# EAGLE design ble_emg_recorder_v11 (EAGLE 6.4)

## Sheet 1 of 3
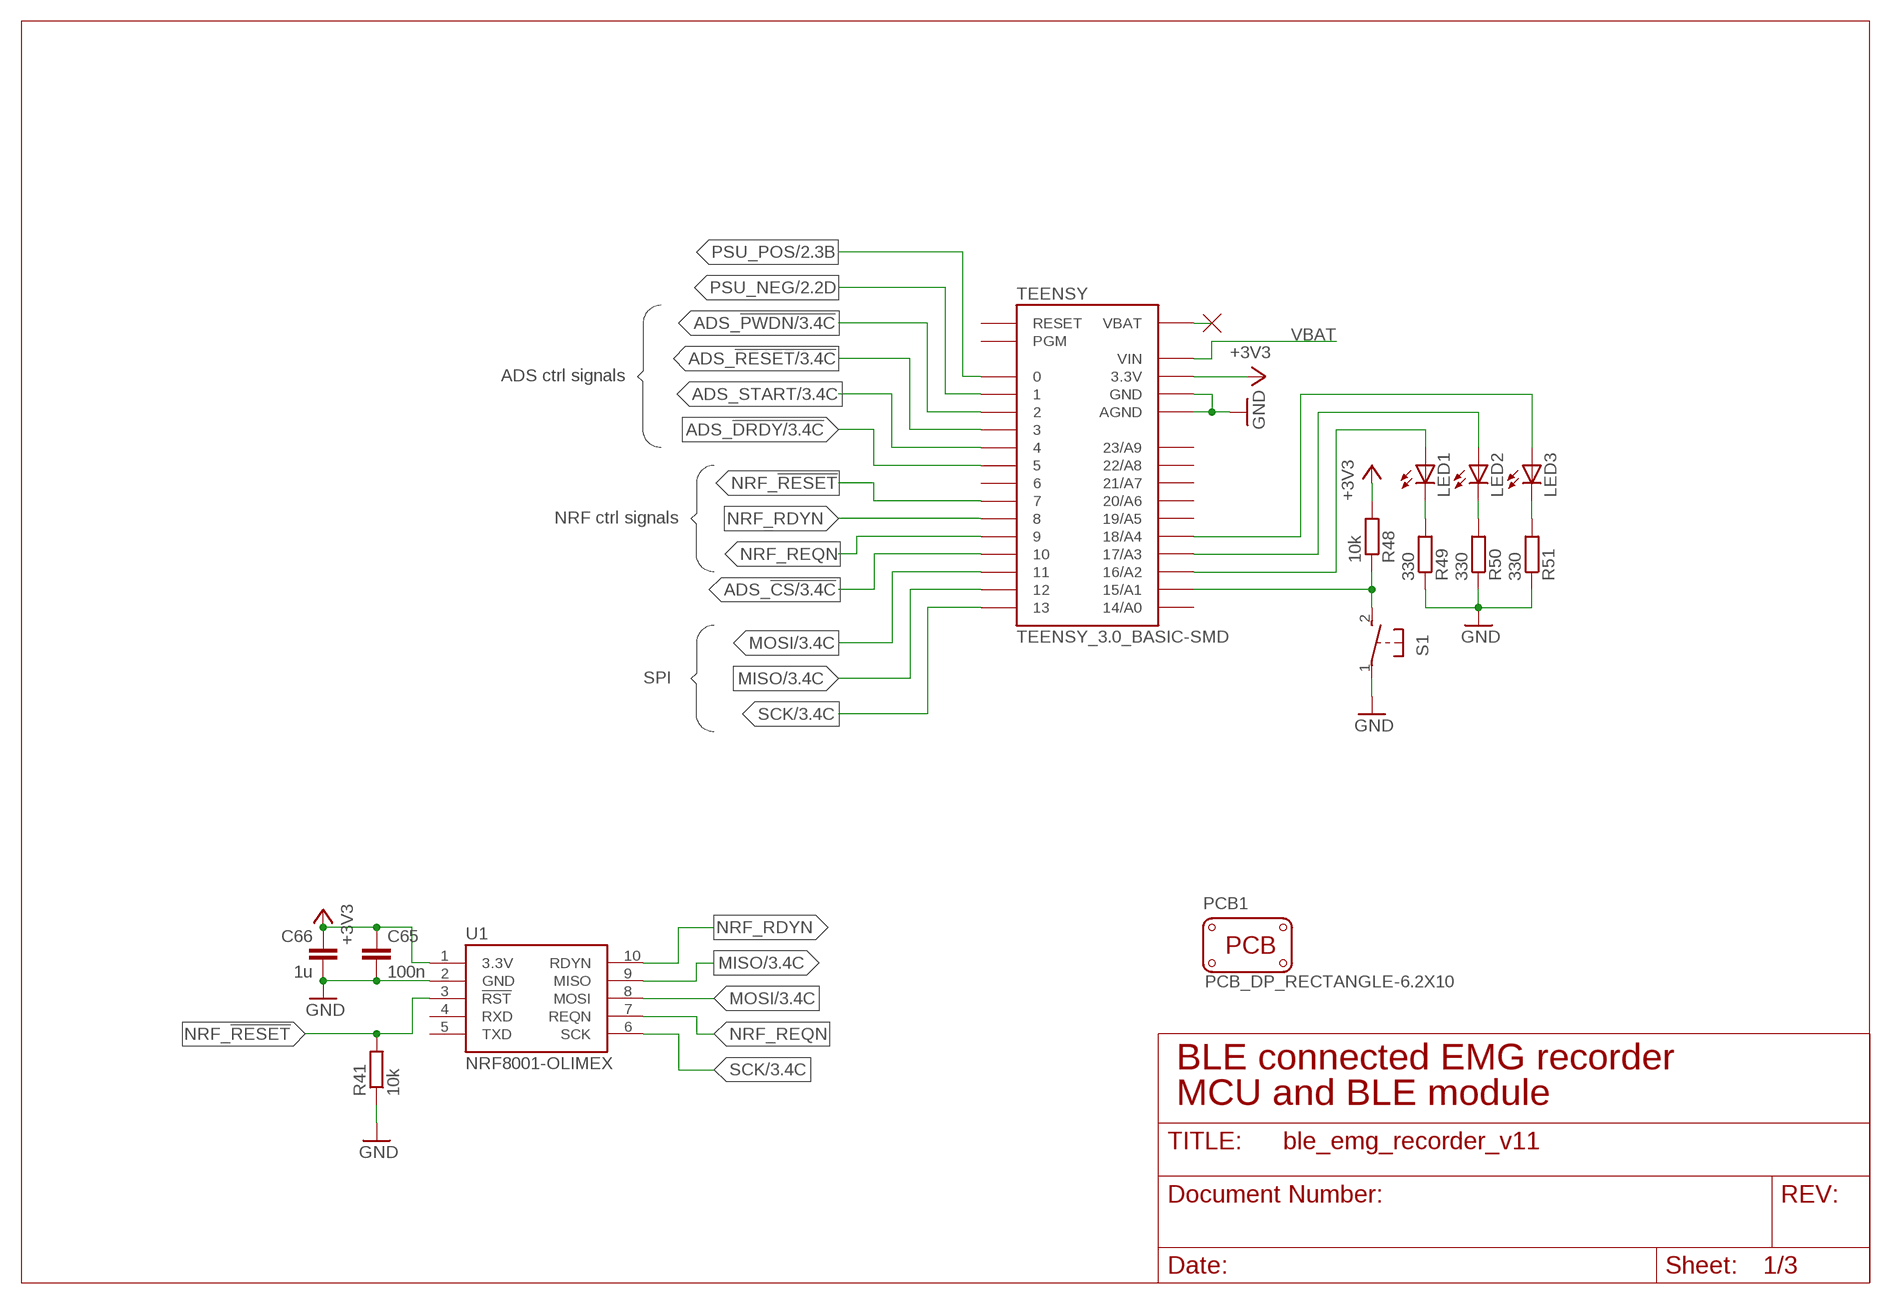
[diagram p0: schematic, sheet 1]

### Parts
C65  100n  C-EUC0805  [C0805]
C66  1u  C-EUC0805  [C0805]
LED1  LEDCHIPLED_0805  [CHIPLED_0805]
LED2  LEDCHIPLED_0805  [CHIPLED_0805]
LED3  LEDCHIPLED_0805  [CHIPLED_0805]
PCB1  PCB_DP_RECTANGLE-6.2X10  [DP10062_V1]
R41  10k  R-EU_R0805  [R0805]
R48  10k  R-EU_R0805  [R0805]
R49  330  R-EU_R0805  [R0805]
R50  330  R-EU_R0805  [R0805]
R51  330  R-EU_R0805  [R0805]
S1  31-XX  [B3F-31XX]
TEENSY  TEENSY_3.0_BASIC-SMD  [TEENSY_3.0_BASIC-SMD]
U1  NRF8001-OLIMEX  [NRF8001-OLIMEX]

### Nets
+3V3: C65.1 C66.1 R48.2 TEENSY.3.3V TEENSY.3.3V1(3.3V) U1.1(3.3V) ; also sheet 3
ADS_!CS: TEENSY.10 ; also sheet 3
ADS_!DRDY: TEENSY.5 ; also sheet 3
ADS_!PWDN: TEENSY.2 ; also sheet 3
ADS_!RESET: TEENSY.3 ; also sheet 3
ADS_START: TEENSY.4 ; also sheet 3
GND: C65.2 C66.2 R41.1 R49.1 R50.1 R51.1 S1.1(P) TEENSY.AGND TEENSY.GND TEENSY.GND1(GND) U1.2(GND) ; also sheet 2,3
MISO: TEENSY.12 U1.9(MISO) ; also sheet 3
MOSI: TEENSY.11 U1.8(MOSI) ; also sheet 3
N$4: R48.1 S1.2(S) TEENSY.15/A1
N$7: LED1.A TEENSY.16/A2
N$9: TEENSY.VBAT
N$10: LED2.A TEENSY.17/A3
N$13: LED3.A TEENSY.18/A4
N$16: LED1.C R49.2
N$19: LED2.C R50.2
N$22: LED3.C R51.2
NRF_!RESET: R41.2 TEENSY.7 U1.3(!RST)
NRF_RDYN: TEENSY.8 U1.10(RDYN)
NRF_REQN: TEENSY.9 U1.7(REQN)
PSU_NEG: TEENSY.1 ; also sheet 2
PSU_POS: TEENSY.0 ; also sheet 2
SCK: TEENSY.13 U1.6(SCK) ; also sheet 3
VBAT: TEENSY.VIN ; also sheet 2
Unconnected: TEENSY.6 TEENSY.14/A0 TEENSY.19/A5 TEENSY.20/A6 TEENSY.21/A7 TEENSY.22/A8 TEENSY.23/A9 TEENSY.PGM TEENSY.RESET U1.4(RXD) U1.5(TXD)

### Notes on the sheet
- ADS ctrl signals
- NRF ctrl signals
- SPI
- BLE connected EMG recorder
- MCU and BLE module

## Sheet 2 of 3
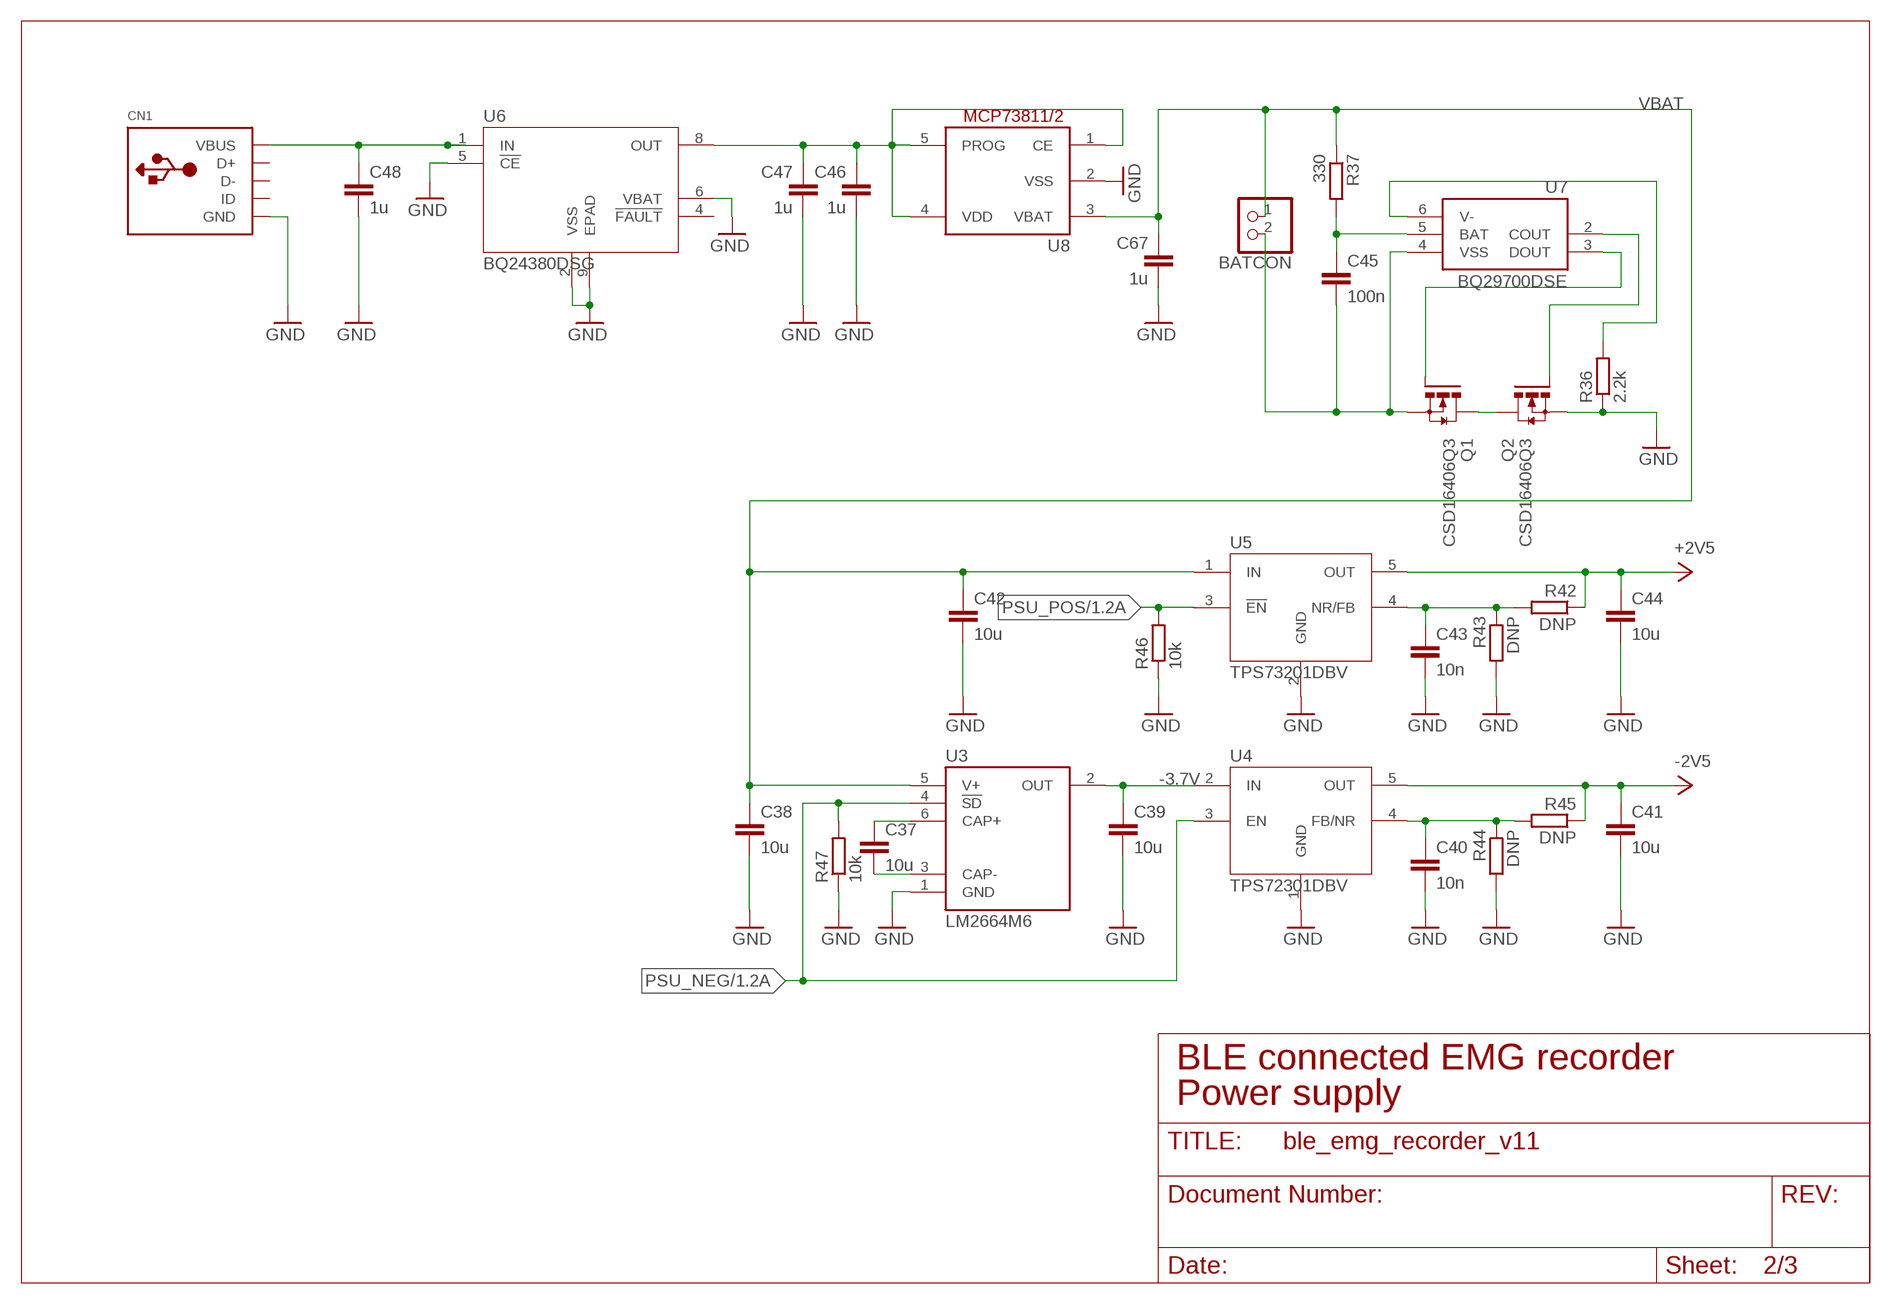
[diagram p1: schematic, sheet 2]

### Parts
BATCON  JST_2PIN-THM-RA  [JST-PH-2-THM-RA]
C37  10u  C-EUC0805  [C0805]
C38  10u  C-EUC0805  [C0805]
C39  10u  C-EUC0805  [C0805]
C40  10n  C-EUC0805  [C0805]
C41  10u  C-EUC0805  [C0805]
C42  10u  C-EUC0805  [C0805]
C43  10n  C-EUC0805  [C0805]
C44  10u  C-EUC0805  [C0805]
C45  100n  C-EUC0805  [C0805]
C46  1u  C-EUC0805  [C0805]
C47  1u  C-EUC0805  [C0805]
C48  1u  C-EUC0805  [C0805]
C67  1u  C-EUC0805  [C0805]
CN1  USBMINIB  [USB-MINIB]
Q1  CSD16406Q3  [DQV8-L]
Q2  CSD16406Q3  [DQV8-L]
R36  2.2k  R-EU_R0805  [R0805]
R37  330  R-EU_R0805  [R0805]
R42  DNP  R-EU_R0805  [R0805]
R43  DNP  R-EU_R0805  [R0805]
R44  DNP  R-EU_R0805  [R0805]
R45  DNP  R-EU_R0805  [R0805]
R46  10k  R-EU_R0805  [R0805]
R47  10k  R-EU_R0805  [R0805]
U3  LM2664M6  [SOT95P300X120-6N]
U4  TPS72301DBV  [DBV5]
U5  TPS73201DBV  [DBV5]
U6  BQ24380DSG  [DSG8_P9X1P6]
U7  BQ29700DSE  [DSE6]
U8  MCP73811/2  [SOT23-5L]

### Nets
+2V5: C44.1 R42.1 U5.5(OUT) ; also sheet 3
-2V5: C41.1 R45.1 U4.5(OUT) ; also sheet 3
GND: C38.2 C39.2 C40.2 C41.2 C42.2 C43.2 C44.2 C46.2 C47.2 C48.2 C67.2 CN1.GND Q2.1(S) Q2.2(S) Q2.3(S) R36.1 R43.2 R44.2 R46.1 R47.1 U3.1(GND) U4.1(GND) U5.2(GND) U6.2(VSS) U6.5(!CE) U6.6(VBAT) U6.9(EPAD) U8.2(VSS) ; also sheet 1,3
N$1: C40.1 R44.1 R45.2 U4.4(FB/NR)
N$3: C46.1 C47.1 U6.8(OUT) U8.1(CE) U8.4(VDD) U8.5(PROG)
N$21: C37.1 U3.6(CAP+)
N$27: C37.2 U3.3(CAP-)
N$30: C39.1 U3.2(OUT) U4.2(IN)
N$36: C43.1 R42.2 R43.1 U5.4(NR/FB)
N$39: BATCON.2 C45.2 Q1.1(S) Q1.2(S) Q1.3(S) U7.4(VSS)
N$42: Q2.4(G) U7.2(COUT)
N$45: Q1.4(G) U7.3(DOUT)
N$48: R36.2 U7.6(V-)
N$49: C45.1 R37.2 U7.5(BAT)
N$50: Q1.5(D) Q1.6(D) Q1.7(D) Q1.8(D) Q2.5(D) Q2.6(D) Q2.7(D) Q2.8(D)
PSU_NEG: R47.2 U3.4(!SD) U4.3(EN) ; also sheet 1
PSU_POS: R46.2 U5.3(!EN) ; also sheet 1
VAC: C48.1 CN1.VBUS U6.1(IN)
VBAT: BATCON.1 C38.1 C42.1 C67.1 R37.1 U3.5(V+) U5.1(IN) U8.3(VBAT) ; also sheet 1
Unconnected: CN1.D+ CN1.D- CN1.ID U6.4(!FAULT)

### Notes on the sheet
- -3.7V
- BLE connected EMG recorder
- Power supply

## Sheet 3 of 3
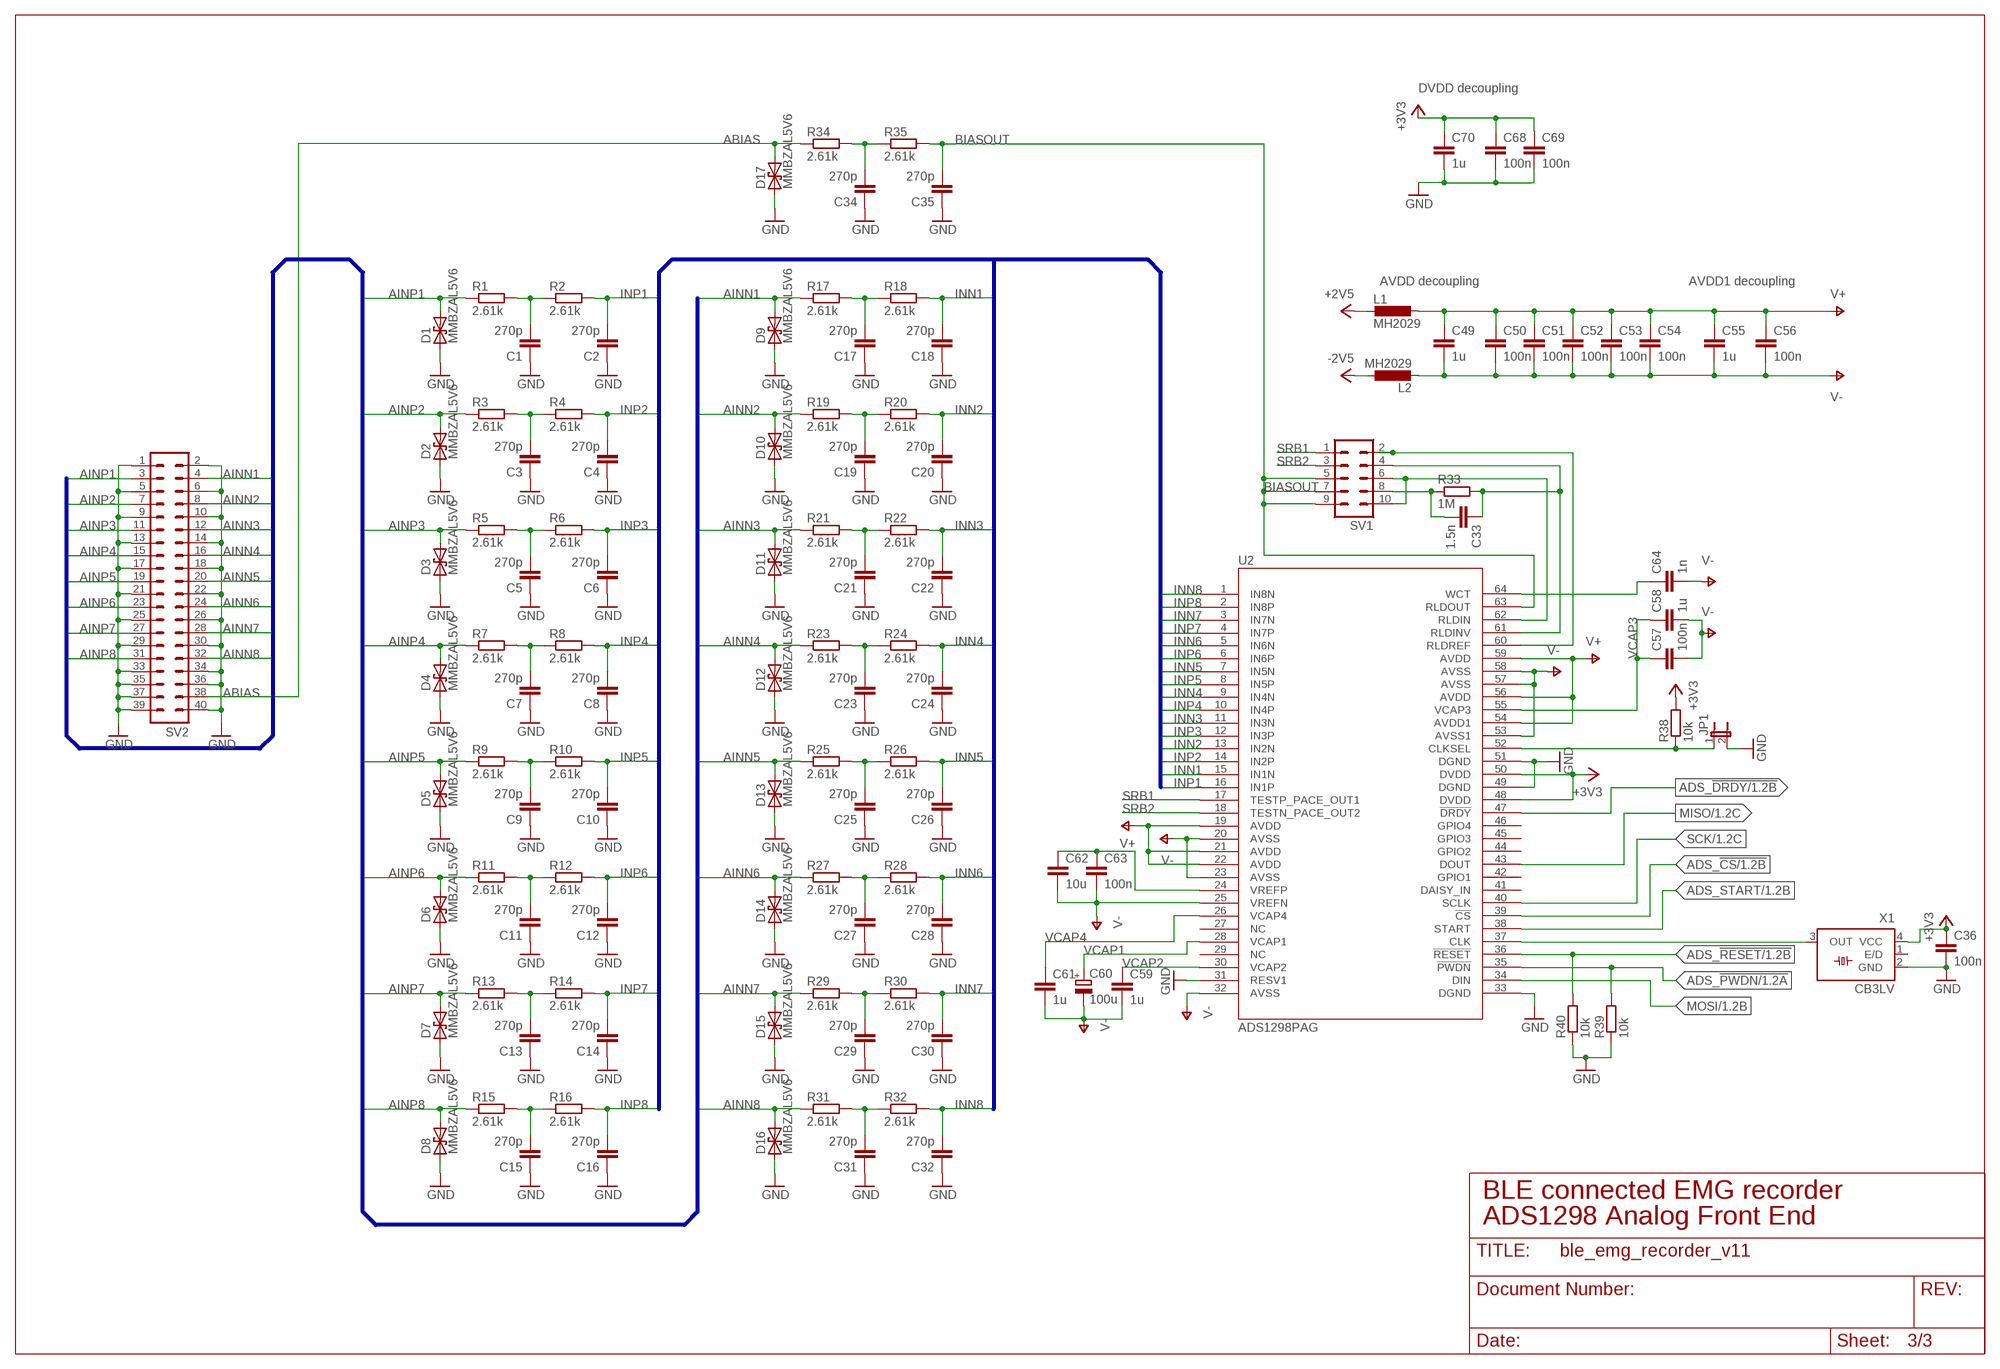
[diagram p2: schematic, sheet 3]

### Parts
C1  270p  C-EUC0805  [C0805]
C2  270p  C-EUC0805  [C0805]
C3  270p  C-EUC0805  [C0805]
C4  270p  C-EUC0805  [C0805]
C5  270p  C-EUC0805  [C0805]
C6  270p  C-EUC0805  [C0805]
C7  270p  C-EUC0805  [C0805]
C8  270p  C-EUC0805  [C0805]
C9  270p  C-EUC0805  [C0805]
C10  270p  C-EUC0805  [C0805]
C11  270p  C-EUC0805  [C0805]
C12  270p  C-EUC0805  [C0805]
C13  270p  C-EUC0805  [C0805]
C14  270p  C-EUC0805  [C0805]
C15  270p  C-EUC0805  [C0805]
C16  270p  C-EUC0805  [C0805]
C17  270p  C-EUC0805  [C0805]
C18  270p  C-EUC0805  [C0805]
C19  270p  C-EUC0805  [C0805]
C20  270p  C-EUC0805  [C0805]
C21  270p  C-EUC0805  [C0805]
C22  270p  C-EUC0805  [C0805]
C23  270p  C-EUC0805  [C0805]
C24  270p  C-EUC0805  [C0805]
C25  270p  C-EUC0805  [C0805]
C26  270p  C-EUC0805  [C0805]
C27  270p  C-EUC0805  [C0805]
C28  270p  C-EUC0805  [C0805]
C29  270p  C-EUC0805  [C0805]
C30  270p  C-EUC0805  [C0805]
C31  270p  C-EUC0805  [C0805]
C32  270p  C-EUC0805  [C0805]
C33  1.5n  C-EUC0805  [C0805]
C34  270p  C-EUC0805  [C0805]
C35  270p  C-EUC0805  [C0805]
C36  100n  C-EUC0805  [C0805]
C49  1u  C-EUC0805  [C0805]
C50  100n  C-EUC0402  [C0402]
C51  100n  C-EUC0402  [C0402]
C52  100n  C-EUC0402  [C0402]
C53  100n  C-EUC0402  [C0402]
C54  100n  C-EUC0402  [C0402]
C55  1u  C-EUC0805  [C0805]
C56  100n  C-EUC0402  [C0402]
C57  100n  C-EUC0402  [C0402]
C58  1u  C-EUC0805  [C0805]
C59  1u  C-EUC0805  [C0805]
C60  100u  CPOL-EUD/7343-31W  [D/7343-31W]
C61  1u  C-EUC0805  [C0805]
C62  10u  C-EUC0805  [C0805]
C63  100n  C-EUC0402  [C0402]
C64  1n  C-EUC0402  [C0402]
C68  100n  C-EUC0402  [C0402]
C69  100n  C-EUC0402  [C0402]
C70  1u  C-EUC0805  [C0805]
D1  MMBZAL5V6  [SOT23]
D2  MMBZAL5V6  [SOT23]
D3  MMBZAL5V6  [SOT23]
D4  MMBZAL5V6  [SOT23]
D5  MMBZAL5V6  [SOT23]
D6  MMBZAL5V6  [SOT23]
D7  MMBZAL5V6  [SOT23]
D8  MMBZAL5V6  [SOT23]
D9  MMBZAL5V6  [SOT23]
D10  MMBZAL5V6  [SOT23]
D11  MMBZAL5V6  [SOT23]
D12  MMBZAL5V6  [SOT23]
D13  MMBZAL5V6  [SOT23]
D14  MMBZAL5V6  [SOT23]
D15  MMBZAL5V6  [SOT23]
D16  MMBZAL5V6  [SOT23]
D17  MMBZAL5V6  [SOT23]
JP1  JP1E  [JP1]
L1  MH2029  FERRITE-FILTER  [L0805]
L2  MH2029  FERRITE-FILTER  [L0805]
R1  2.61k  R-EU_R0805  [R0805]
R2  2.61k  R-EU_R0805  [R0805]
R3  2.61k  R-EU_R0805  [R0805]
R4  2.61k  R-EU_R0805  [R0805]
R5  2.61k  R-EU_R0805  [R0805]
R6  2.61k  R-EU_R0805  [R0805]
R7  2.61k  R-EU_R0805  [R0805]
R8  2.61k  R-EU_R0805  [R0805]
R9  2.61k  R-EU_R0805  [R0805]
R10  2.61k  R-EU_R0805  [R0805]
R11  2.61k  R-EU_R0805  [R0805]
R12  2.61k  R-EU_R0805  [R0805]
R13  2.61k  R-EU_R0805  [R0805]
R14  2.61k  R-EU_R0805  [R0805]
R15  2.61k  R-EU_R0805  [R0805]
R16  2.61k  R-EU_R0805  [R0805]
R17  2.61k  R-EU_R0805  [R0805]
R18  2.61k  R-EU_R0805  [R0805]
R19  2.61k  R-EU_R0805  [R0805]
R20  2.61k  R-EU_R0805  [R0805]
R21  2.61k  R-EU_R0805  [R0805]
R22  2.61k  R-EU_R0805  [R0805]
R23  2.61k  R-EU_R0805  [R0805]
R24  2.61k  R-EU_R0805  [R0805]
R25  2.61k  R-EU_R0805  [R0805]
R26  2.61k  R-EU_R0805  [R0805]
R27  2.61k  R-EU_R0805  [R0805]
R28  2.61k  R-EU_R0805  [R0805]
R29  2.61k  R-EU_R0805  [R0805]
R30  2.61k  R-EU_R0805  [R0805]
R31  2.61k  R-EU_R0805  [R0805]
R32  2.61k  R-EU_R0805  [R0805]
R33  1M  R-EU_R0805  [R0805]
R34  2.61k  R-EU_R0805  [R0805]
R35  2.61k  R-EU_R0805  [R0805]
R38  10k  R-EU_R0805  [R0805]
R39  10k  R-EU_R0805  [R0805]
R40  10k  R-EU_R0805  [R0805]
SV1  MA05-2  [MA05-2]
SV2  ML40  [ML40]
U2  ADS1298PAG  [PAG64]
X1  CB3LV  SM77H  [SM77H]

### Nets
+2V5: L1.2 ; also sheet 2
+3V3: C36.1 C68.1 C69.1 C70.1 R38.2 U2.48(DVDD) U2.50(DVDD) X1.4(VCC) ; also sheet 1
-2V5: L2.1 ; also sheet 2
ABIAS: D17.2 R34.1 SV2.38
ADS_!CS: U2.39(!CS) ; also sheet 1
ADS_!DRDY: U2.47(!DRDY) ; also sheet 1
ADS_!PWDN: R39.2 U2.35(!PWDN) ; also sheet 1
ADS_!RESET: R40.2 U2.36(!RESET) ; also sheet 1
ADS_CLK: U2.37(CLK) X1.3(OUT)
ADS_START: U2.38(START) ; also sheet 1
AINN1: D9.2 R17.1 SV2.4
AINN2: D10.2 R19.1 SV2.8
AINN3: D11.2 R21.1 SV2.12
AINN4: D12.2 R23.1 SV2.16
AINN5: D13.2 R25.1 SV2.20
AINN6: D14.2 R27.1 SV2.24
AINN7: D15.2 R29.1 SV2.28
AINN8: D16.2 R31.1 SV2.32
AINP1: D1.2 R1.1 SV2.3
AINP2: D2.2 R3.1 SV2.7
AINP3: D3.2 R5.1 SV2.11
AINP4: D4.2 R7.1 SV2.15
AINP5: D5.2 R9.1 SV2.19
AINP6: D6.2 R11.1 SV2.23
AINP7: D7.2 R13.1 SV2.27
AINP8: D8.2 R15.1 SV2.31
BIASOUT: C35.2 R35.2 SV1.5 SV1.7 SV1.9 U2.63(RLDOUT)
GND: C1.1 C2.1 C3.1 C4.1 C5.1 C6.1 C7.1 C8.1 C9.1 C10.1 C11.1 C12.1 C13.1 C14.1 C15.1 C16.1 C17.1 C18.1 C19.1 C20.1 C21.1 C22.1 C23.1 C24.1 C25.1 C26.1 C27.1 C28.1 C29.1 C30.1 C31.1 C32.1 C34.1 C35.1 C36.2 C68.2 C69.2 C70.2 D1.1 D2.1 D3.1 D4.1 D5.1 D6.1 D7.1 D8.1 D9.1 D10.1 D11.1 D12.1 D13.1 D14.1 D15.1 D16.1 D17.1 JP1.2 R39.1 R40.1 SV2.1 SV2.2 SV2.5 SV2.6 SV2.9 SV2.10 SV2.13 SV2.14 SV2.17 SV2.18 SV2.21 SV2.22 SV2.25 SV2.26 SV2.29 SV2.30 SV2.33 SV2.34 SV2.35 SV2.36 SV2.37 SV2.39 SV2.40 U2.31(RESV1) U2.33(DGND) U2.49(DGND) U2.51(DGND) X1.2(GND) ; also sheet 1,2
INN1: C18.2 R18.2 U2.15(IN1N)
INN2: C20.2 R20.2 U2.13(IN2N)
INN3: C22.2 R22.2 U2.11(IN3N)
INN4: C24.2 R24.2 U2.9(IN4N)
INN5: C26.2 R26.2 U2.7(IN5N)
INN6: C28.2 R28.2 U2.5(IN6N)
INN7: C30.2 R30.2 U2.3(IN7N)
INN8: C32.2 R32.2 U2.1(IN8N)
INP1: C2.2 R2.2 U2.16(IN1P)
INP2: C4.2 R4.2 U2.14(IN2P)
INP3: C6.2 R6.2 U2.12(IN3P)
INP4: C8.2 R8.2 U2.10(IN4P)
INP5: C10.2 R10.2 U2.8(IN5P)
INP6: C12.2 R12.2 U2.6(IN6P)
INP7: C14.2 R14.2 U2.4(IN7P)
INP8: C16.2 R16.2 U2.2(IN8P)
MISO: U2.43(DOUT) ; also sheet 1
MOSI: U2.34(DIN) ; also sheet 1
N$2: C1.2 R1.2 R2.1
N$5: C3.2 R3.2 R4.1
N$6: C34.2 R34.2 R35.1
N$8: C5.2 R5.2 R6.1
N$11: C7.2 R7.2 R8.1
N$12: SV1.6 SV1.10 U2.62(RLDIN)
N$14: C9.2 R9.2 R10.1
N$15: C33.2 R33.1 SV1.8
N$17: C11.2 R11.2 R12.1
N$18: C33.1 R33.2 SV1.4 U2.61(RLDINV)
N$20: C13.2 R13.2 R14.1
N$23: C15.2 R15.2 R16.1
N$24: SV1.2 U2.60(RLDREF)
N$26: C17.2 R17.2 R18.1
N$29: C19.2 R19.2 R20.1
N$32: C21.2 R21.2 R22.1
N$35: C23.2 R23.2 R24.1
N$38: C25.2 R25.2 R26.1
N$41: C27.2 R27.2 R28.1
N$44: C29.2 R29.2 R30.1
N$47: C31.2 R31.2 R32.1
N$51: JP1.1 R38.1 U2.52(CLKSEL)
N$58: C64.1 U2.64(WCT)
SCK: U2.40(SCLK) ; also sheet 1
SRB1: SV1.1 U2.17(TESTP_PACE_OUT1)
SRB2: SV1.3 U2.18(TESTN_PACE_OUT2)
V+: C49.1 C50.1 C51.1 C52.1 C53.1 C54.1 C55.1 C56.1 L1.1 U2.19(AVDD) U2.21(AVDD) U2.22(AVDD) U2.54(AVDD1) U2.56(AVDD) U2.59(AVDD)
V-: C49.2 C50.2 C51.2 C52.2 C53.2 C54.2 C55.2 C56.2 C57.2 C58.2 C59.2 C60.- C61.2 C62.2 C63.2 C64.2 L2.2 U2.20(AVSS) U2.23(AVSS) U2.25(VREFN) U2.32(AVSS) U2.53(AVSS1) U2.57(AVSS) U2.58(AVSS)
VCAP1: C60.+ U2.28(VCAP1)
VCAP2: C59.1 U2.30(VCAP2)
VCAP3: C57.1 C58.1 U2.55(VCAP3)
VCAP4: C61.1 U2.26(VCAP4)
VREFP: C62.1 C63.1 U2.24(VREFP)
Unconnected: U2.27(NC) U2.29(NC) U2.41(DAISY_IN) U2.42(GPIO1) U2.44(GPIO2) U2.45(GPIO3) U2.46(GPIO4) X1.1(E/D)

### Buses
ADS-INPUTS:INP[1..8],INN[1..8]
ANALOG-INPUTS:AINN[1..8],AINP[1..8]

### Notes on the sheet
- DVDD decoupling
- AVDD decoupling | AVDD1 decoupling
- BLE connected EMG recorder
- ADS1298 Analog Front End

## Library data of the parts
BATCON = adafruit:JST_2PIN: JST 2-Pin Connectors of various flavors SMT-RA (S2B-PH-SM4) 4UConnector #17311 SMT (B2B-PH-SM4) THM-RA (S2B-PH) THM (B2B-PH); DIGIKEY: 455-1719-ND
C1-C32 C34 C35 = rcl:C-EU: CAPACITOR, European symbol; DIGIKEY: 1276-2494-1-ND
C33 = rcl:C-EU: CAPACITOR, European symbol; DIGIKEY: 1276-1794-1-ND
C36 C45 C65 = rcl:C-EU: CAPACITOR, European symbol; DIGIKEY: 1276-1099-1-ND
C37-C39 C41 C42 C44 C62 = rcl:C-EU: CAPACITOR, European symbol; DIGIKEY: 1276-2891-1-ND
C40 C43 = rcl:C-EU: CAPACITOR, European symbol; DIGIKEY: 1276-1015-1-ND
C46-C49 C55 C58 C59 C61 C66 C67 C70 = rcl:C-EU: CAPACITOR, European symbol; DIGIKEY: 1276-1066-1-ND
C50-C54 C56 C57 C63 C68 C69 = rcl:C-EU: CAPACITOR, European symbol; DIGIKEY: 1276-1443-1-ND
C60 = rcl:CPOL-EU: POLARIZED CAPACITOR, European symbol; DIGIKEY: 399-3772-1-ND
C64 = rcl:C-EU: CAPACITOR, European symbol; DIGIKEY: 311-1036-1-ND
CN1 = adafruit:USB: USB Connectors USBMINIB - Surface Mount Female Mini-B USB Connector 4UConnector: 06564 By microbuilder.eu Thru-hole RA Female Mini-B USB Connector 4UConnector: 18732 By ladyada.net; DIGIKEY: ED2992CT-ND
D1-D17 = proj_ble_emg:MMBZ?AL: MMBZxAL series Low capacitance unidirectiona l double ESD protection diodes Source: http://www.nxp.com/documents/data_sheet/MMBZXAL_SER.pdf; DIGIKEY: 568-6347-1-ND
JP1 = jumper:JP1E: JUMPER
L1 L2 = proj_ble_emg:FERRITE-FILTER; DIGIKEY: MH2029-221YCT-ND
LED1-LED3 = led:LED: LED OSRAM: - CHIPLED LG R971, LG N971, LY N971, LG Q971, LY Q971, LO R971, LY R971 LH N974, LH R974 LS Q976, LO Q976, LY Q976 LO Q996 - Hyper CHIPLED LW Q18S LB Q993, LB Q99A, LB R99A - SideLED LS A670, LO A670, LY A670, LG A670, LP A670 LB A673, LV A673, LT A673, LW A673 LH A674 LY A675 LS A676, LA A676, LO A676, LY A676, LW A676 LS A679, LY A679, LG A679 - Hyper Micro SIDELED® LS Y876, LA Y876, LO Y876, LY Y876 LT Y87S - SmartLED LW L88C, LW L88S LB L89C, LB L89S, LG L890 LS L89K, LO L89K, LY L89K LS L896, LA L896, LO L896, LY L896 - TOPLED LS T670, LO T670, LY T670, LG T670, LP T670 LSG T670, LSP T670, LSY T670, LOP T670, LYG T670 LG T671, LOG T671, LSG T671 LB T673, LV T673, LT T673, LW T673 LH T674 LS T676, LA T676, LO T676, LY T676, LB T676, LH T676, LSB T676, LW T676 LB T67C, LV T67C, LT T67C, LS T67K, LO T67K, LY T67K, LW E67C LS E67B, LA E67B, LO E67B, LY E67B, LB E67C, LV E67C, LT E67C LW T67C LS T679, LY T679, LG T679 LS T770, LO T770, LY T770, LG T770, LP T770 LB T773, LV T773, LT T773, LW T773 LH T774 LS E675, LA E675, LY E675, LS T675 LS T776, LA T776, LO T776, LY T776, LB T776 LHGB T686 LT T68C, LB T68C - Hyper Mini TOPLED® LB M676 - Mini TOPLED Santana® LG M470 LS M47K, LO M47K, LY M47K Source: http://www.osram.convergy.de LUXEON: - LUMILED® LXK2-PW12-R00, LXK2-PW12-S00, LXK2-PW14-U00, LXK2-PW14-V00 LXK2-PM12-R00, LXK2-PM12-S00, LXK2-PM14-U00 LXK2-PE12-Q00, LXK2-PE12-R00, LXK2-PE12-S00, LXK2-PE14-T00, LXK2-PE14-U00 LXK2-PB12-K00, LXK2-PB12-L00, LXK2-PB12-M00, LXK2-PB14-N00, LXK2-PB14-P00, LXK2-PB14-Q00 LXK2-PR12-L00, LXK2-PR12-M00, LXK2-PR14-Q00, LXK2-PR14-R00 LXK2-PD12-Q00, LXK2-PD12-R00, LXK2-PD12-S00 LXK2-PH12-R00, LXK2-PH12-S00 LXK2-PL12-P00, LXK2-PL12-Q00, LXK2-PL12-R00 Source: www.luxeon.com KINGBRIGHT: KA-3528ASYC Source: www.kingbright.com
PCB1 = proj_ble_emg:PCB_DP_RECTANGLE: Dangerous Prototypes Standard Rectangular PCB sizes
Q1 Q2 = proj_ble_emg:CSD16406Q3; DIGIKEY: 296-24251-1-ND
R1-R32 R34 R35 = rcl:R-EU_: RESISTOR, European symbol; DIGIKEY: RMCF0805FT2K61CT-ND
R33 = rcl:R-EU_: RESISTOR, European symbol; DIGIKEY: RMCF0805JT1M00CT-ND
R36 = rcl:R-EU_: RESISTOR, European symbol; DIGIKEY: RMCF0805JT2K20CT-ND
R37 R49-R51 = rcl:R-EU_: RESISTOR, European symbol; DIGIKEY: RMCF0805JT330RCT-ND
R38-R48 = rcl:R-EU_: RESISTOR, European symbol
S1 = switch-omron:31-XX: OMRON SWITCH; MPN: B3F-3100; OC_FARNELL: 959704; OC_NEWARK: 36M3582
SV1 = con-lstb:MA05-2: PIN HEADER; OC_FARNELL: unknown; OC_NEWARK: unknown
SV2 = con-ml:ML40: HARTING; DIGIKEY: S9175-ND; OC_FARNELL: unknown; OC_NEWARK: unknown
TEENSY = proj_ble_emg:TEENSY_3.0_BASIC-?: Basic Teensy 3.0 with none of the 'inner' pins enabled. See '+4', 'AllAnalogPins", and 'AllPins' packages for additional pin holes, as needed.
U1 = proj_ble_emg:NRF8001-OLIMEX: MOD-nRF8001 Bluetooth Low Energy module based on nRF8001 chipset Source: https://www.olimex.com/Products/Modules/RF/MOD-nRF8001/
U2 = proj_ble_emg:ADS1298*; DATASHEETURL: http://www.ti.com/lit/gpn/ADS1298; DESCRIPTION: 8-Channel, 24-Bit Analog-To-Digital Converter With Integrated ECG Front End; DIGIKEY: 296-27734-ND; FAMILY_NAME: ECG / EEG Analog Front End; GENERIC_PART_NUMBER: ADS1298; INDUSTRY_STD_PKG_TYPE: TQFP; MANUFACTURER: Texas Instruments; PACKAGE_DESIGNATOR: PAG; PIN_COUNT: 64
U3 = ferdinandkeil:LM2664M6: Switched Capacitor Voltage Converter; DIGIKEY: LM2664M6CT-ND; MPN: LM2664M6; OC_FARNELL: 9779671; OC_NEWARK: -; PACKAGE: SOT-23-6; SUPPLIER: NATIONAL SEMICONDUCTOR
U4 = proj_ble_emg:TPS72301*; DATASHEETURL: http://www.ti.com/lit/gpn/TPS72301; DESCRIPTION: 200mA, Negative Output Low-Dropout Linear Regulator; DIGIKEY: 296-15799-1-ND; FAMILY_NAME: SINGLE CHANNEL LDO; GENERIC_PART_NUMBER: TPS72301; INDUSTRY_STD_PKG_TYPE: SOT-23; MANUFACTURER: Texas Instruments; MANUFACTURER_PART_NUMBER: tps72301_dbv_5; PACKAGE_DESIGNATOR: DBV; PIN_COUNT: 5; VENDOR: Texas Instruments
U5 = proj_ble_emg:TPS73201*; DATASHEETURL: http://www.ti.com/lit/gpn/TPS73201; DESCRIPTION: Single Output LDO, 250mA, Adj.(1.2 to 5.5V), Low Noise, Fast Transient Response; DIGIKEY: 296-15810-1-ND; FAMILY_NAME: SINGLE CHANNEL LDO; GENERIC_PART_NUMBER: TPS73201; INDUSTRY_STD_PKG_TYPE: SOT-23; MANUFACTURER: Texas Instruments; MANUFACTURER_PART_NUMBER: tps73201_dbv_5; PACKAGE_DESIGNATOR: DBV; PIN_COUNT: 5; VENDOR: Texas Instruments
U6 = proj_ble_emg:BQ24380*; DATASHEETURL: http://www.ti.com/lit/gpn/BQ24380; DESCRIPTION: Overvoltage/Overcurrent Protection IC and Li+ Charger Front End Protection IC with LDO Mode, 6.3 OVP; DIGIKEY: 296-23385-1-ND; FAMILY_NAME: CHARGER FRONT END PROTECTION; GENERIC_PART_NUMBER: BQ24380; INDUSTRY_STD_PKG_TYPE: WSON; MANUFACTURER: Texas Instruments; PACKAGE_DESIGNATOR: DSG; PIN_COUNT: 8
U7 = proj_ble_emg:BQ29700*: bq29700 Cost-Effective Voltage and Current Protection Integrated Circuit for Single-Cell Li-Ion/Li-Polymer Batteries Source: http://www.ti.com/lit/ds/symlink/bq29700.pdf; DIGIKEY: 296-37746-1-ND
U8 = adafruit:MCP73811/2: MCP73811 and MCP73812 Simple, Miniature Single-Cell, Fully Integrated Li-Ion / Li-Polymer Charge Management Controllers SOT-23-5 package, no indicator LED but with adjustable current, small and very inexpensive; DIGIKEY: MCP73811T-420I/OTCT-ND
X1 = crystal:SM77H: 3.3V CMOS Clock Oscillator Source: www.pletronics.com .. sm77h%203.3v.pdf; DIGIKEY: CTX1277CT-ND; OC_FARNELL: unknown; OC_NEWARK: unknown

## Board
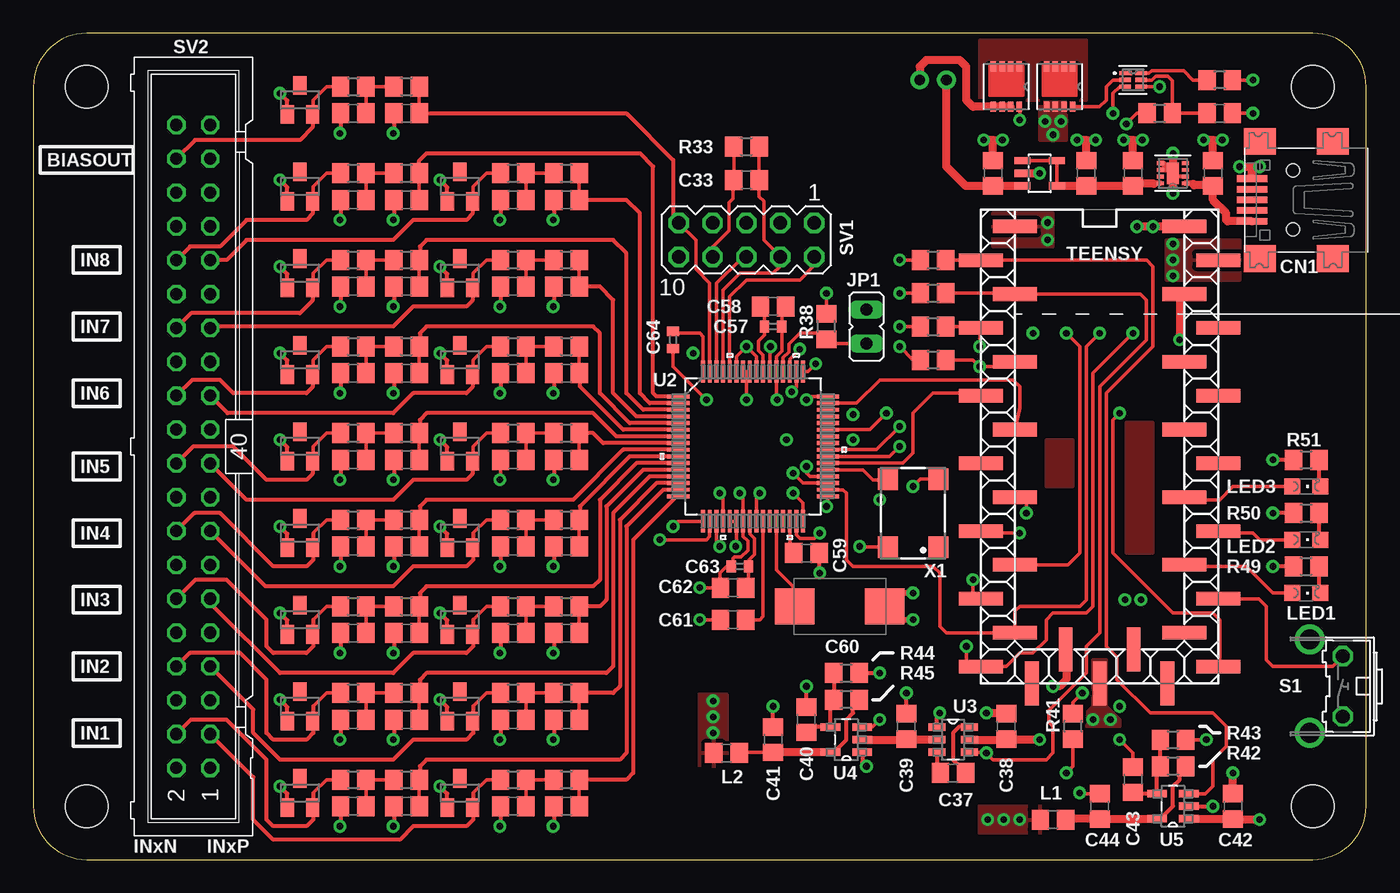
[diagram p3: board, top side]
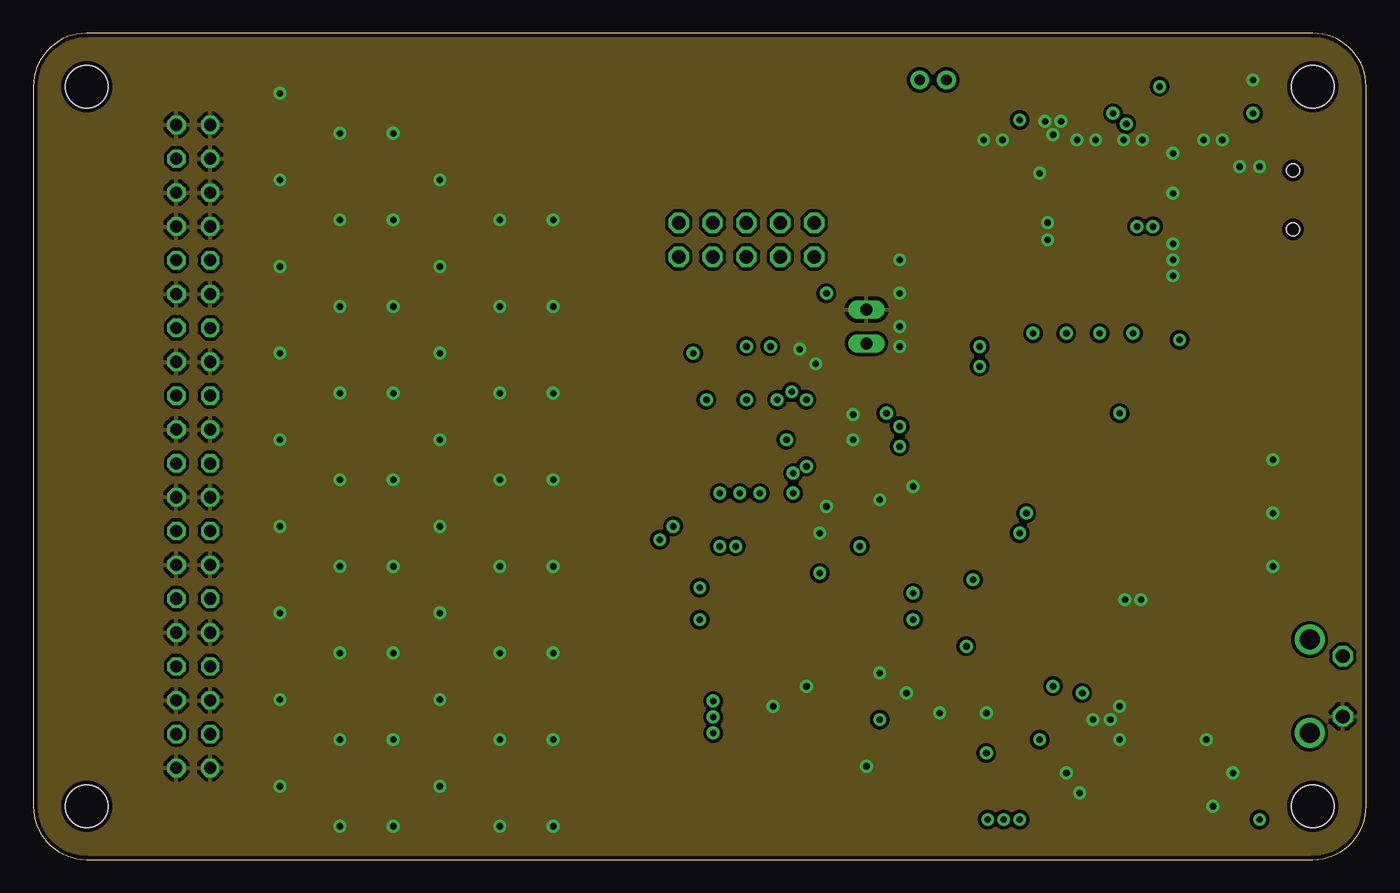
[diagram p4: board, inner layer Route2]
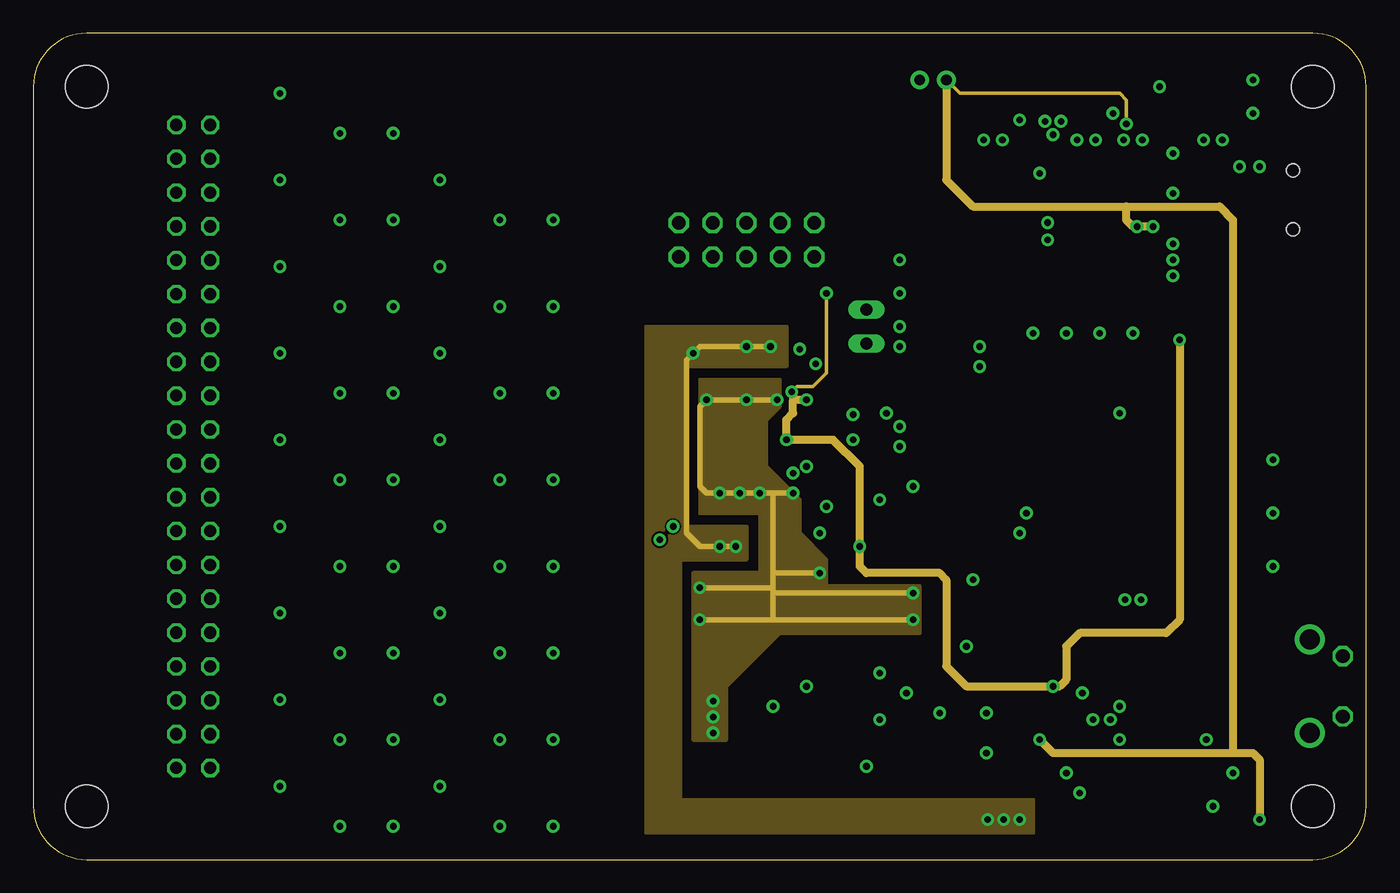
[diagram p5: board, inner layer Route3]
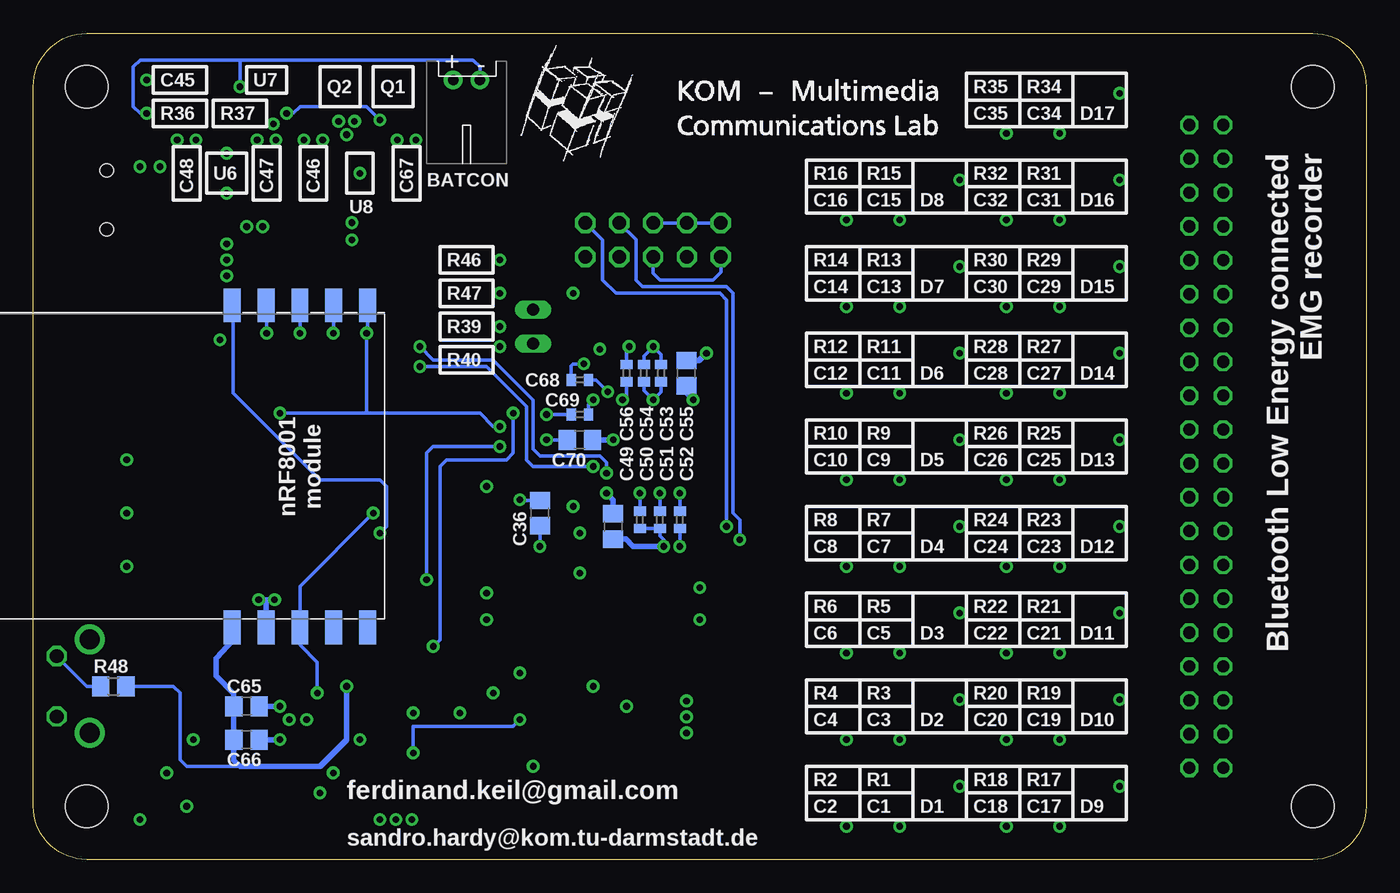
[diagram p6: board, bottom side, seen from below]

Size 100 x 62 mm. Coordinates in mm from the lower left corner, seen from the top.
Copper layers (1*2+3*4+5*6+7*16): Top 0.035mm / dielectric 0.2mm / Route2 0.035mm / dielectric 0.15mm / Route3 0.035mm / dielectric 0.2mm / layer 4 0.035mm / dielectric 0.15mm / layer 5 0.035mm / dielectric 0.2mm / layer 6 0.035mm / dielectric 0.15mm / layer 7 0.035mm / dielectric 0.2mm / Bottom 0.035mm
Design rules "Eagle_WEdirekt_125_check-tentedvias": minimum track width 5mil, minimum drill 0.2mm, track to track 5mil, track to pad 5mil, pad to pad 7mil, via to via 5mil, smd to smd 7mil, copper to edge 12mil, drill to drill 24mil, minimum pad ring 9mil, minimum via ring 9mil, stop-mask expansion 2mil, vias tented up to drill 0.5mm, thermal gap 12mil

### Footprints (pad centres in the part's own frame; a part is rotated, then mirrored left to right if it is on the bottom)
JST-PH-2-THM-RA = drill 0.8 pad 1.422: 1 1,0; 2 -1,0
C0805 = smd 1.3 x 1.5: 1 -0.95,0; 2 0.95,0
C0402 = smd 0.7 x 0.9: 1 -0.65,0; 2 0.65,0
D/7343-31W = smd 2.95 x 2.7: + 3.375,0; - -3.375,0
USB-MINIB = smd 0.5 x 2.308: D+ 0,4.064; D- -0.8,4.064; GND 1.6,4.064; ID 0.8,4.064; VBUS -1.6,4.064 | smd 2 x 2.4: GND1 -4.4,-2; GND2 -4.4,3.5; GND3 4.4,3.5; GND4 4.4,-2 | hole 1: -2.2,1; 2.2,1
SOT23 = smd 1 x 1.4: 1 -0.95,-1.1; 2 0.95,-1.1; 3 0,1.1
JP1 = drill 0.914 long: 1 0,-1.27; 2 0,1.27
L0805 = smd 1.3 x 1.5: 1 -0.95,0; 2 0.95,0
CHIPLED_0805 = smd 1.2 x 1.2: A 0,-1.05; C 0,1.05
DP10062_V1 = hole 3.2: 4,4; 96,4; 96,58; 4,58
DQV8-L = smd 0.762 x 0.406: 1 1.511,-0.975; 2 1.511,-0.325; 3 1.511,0.325; 4 1.511,0.975; 5 -1.511,0.975; 6 -1.511,0.325; 7 -1.511,-0.325; 8 -1.511,-0.975
R0805 = smd 1.3 x 1.5: 1 -0.95,0; 2 0.95,0
B3F-31XX = drill 1.016 octagon: 1 -2.261,-1.245; 2 2.261,-1.245 | drill 1.499 pad 2.159: 3 -3.505,1.245; 4 3.505,1.245
MA05-2 = drill 1.016 octagon: 1 -5.08,-1.27; 2 -5.08,1.27; 3 -2.54,-1.27; 4 -2.54,1.27; 5 0,-1.27; 6 0,1.27; 7 2.54,-1.27; 8 2.54,1.27; 9 5.08,-1.27; 10 5.08,1.27
ML40 = drill 0.914 octagon: 1 -24.13,-1.27; 2 -24.13,1.27; 3 -21.59,-1.27; 4 -21.59,1.27; 5 -19.05,-1.27; 6 -19.05,1.27; 7 -16.51,-1.27; 8 -16.51,1.27; 9 -13.97,-1.27; 10 -13.97,1.27; 11 -11.43,-1.27; 12 -11.43,1.27; 13 -8.89,-1.27; 14 -8.89,1.27; 15 -6.35,-1.27; 16 -6.35,1.27; 17 -3.81,-1.27; 18 -3.81,1.27; 19 -1.27,-1.27; 20 -1.27,1.27; 21 1.27,-1.27; 22 1.27,1.27; 23 3.81,-1.27; 24 3.81,1.27; 25 6.35,-1.27; 26 6.35,1.27; 27 8.89,-1.27; 28 8.89,1.27; 29 11.43,-1.27; 30 11.43,1.27; 31 13.97,-1.27; 32 13.97,1.27; 33 16.51,-1.27; 34 16.51,1.27; 35 19.05,-1.27; 36 19.05,1.27; 37 21.59,-1.27; 38 21.59,1.27; 39 24.13,-1.27; 40 24.13,1.27
TEENSY_3.0_BASIC-SMD = smd 3.302 x 1.016: 0 -8.89,13.97; 1 -6.35,11.43; 2 -8.89,8.89; 3 -6.35,6.35; 3.3V 6.35,11.43; 4 -8.89,3.81; 5 -6.35,1.27; 6 -8.89,-1.27; 7 -6.35,-3.81; 8 -8.89,-6.35; 9 -6.35,-8.89; 10 -8.89,-11.43; 11 -6.35,-13.97; 12 -8.89,-16.51; 13 8.89,-16.51; 14/A0 6.35,-13.97; 15/A1 8.89,-11.43; 16/A2 6.35,-8.89; 17/A3 8.89,-6.35; 18/A4 6.35,-3.81; 19/A5 8.89,-1.27; 20/A6 6.35,1.27; 21/A7 8.89,3.81; 22/A8 6.35,6.35; 23/A9 8.89,8.89; AGND 8.89,13.97; GND -6.35,16.51; VIN 6.35,16.51 | smd 1.016 x 3.302: 3.3V1 -2.54,-15.24; GND1 0,-17.78; PGM 2.54,-15.24; RESET 5.08,-17.78; VBAT -5.08,-17.78
NRF8001-OLIMEX = smd 2.54 x 1.27: 1 -12.085,5.08; 2 -12.085,2.54; 3 -12.085,0; 4 -12.085,-2.54; 5 -12.085,-5.08; 6 12.085,-5.08; 7 12.085,-2.54; 8 12.085,0; 9 12.085,2.54; 10 12.085,5.08
PAG64 = smd 1.676 x 0.279: 1 -5.62,3.75; 2 -5.62,3.25; 3 -5.62,2.75; 4 -5.62,2.25; 5 -5.62,1.75; 6 -5.62,1.25; 7 -5.62,0.75; 8 -5.62,0.25; 9 -5.62,-0.25; 10 -5.62,-0.75; 11 -5.62,-1.25; 12 -5.62,-1.75; 13 -5.62,-2.25; 14 -5.62,-2.75; 15 -5.62,-3.25; 16 -5.62,-3.75; 33 5.62,-3.75; 34 5.62,-3.25; 35 5.62,-2.75; 36 5.62,-2.25; 37 5.62,-1.75; 38 5.62,-1.25; 39 5.62,-0.75; 40 5.62,-0.25; 41 5.62,0.25; 42 5.62,0.75; 43 5.62,1.25; 44 5.62,1.75; 45 5.62,2.25; 46 5.62,2.75; 47 5.62,3.25; 48 5.62,3.75 | smd 0.279 x 1.676: 17 -3.75,-5.62; 18 -3.25,-5.62; 19 -2.75,-5.62; 20 -2.25,-5.62; 21 -1.75,-5.62; 22 -1.25,-5.62; 23 -0.75,-5.62; 24 -0.25,-5.62; 25 0.25,-5.62; 26 0.75,-5.62; 27 1.25,-5.62; 28 1.75,-5.62; 29 2.25,-5.62; 30 2.75,-5.62; 31 3.25,-5.62; 32 3.75,-5.62; 49 3.75,5.62; 50 3.25,5.62; 51 2.75,5.62; 52 2.25,5.62; 53 1.75,5.62; 54 1.25,5.62; 55 0.75,5.62; 56 0.25,5.62; 57 -0.25,5.62; 58 -0.75,5.62; 59 -1.25,5.62; 60 -1.75,5.62; 61 -2.25,5.62; 62 -2.75,5.62; 63 -3.25,5.62; 64 -3.75,5.62
SOT95P300X120-6N = smd 1.27 x 0.559: 1 -1.219,0.94; 2 -1.219,0; 3 -1.219,-0.94; 4 1.219,-0.94; 5 1.219,0; 6 1.219,0.94
DBV5 = smd 1.473 x 0.559: 1 -1.194,0.94; 2 -1.194,0; 3 -1.194,-0.94; 4 1.194,-0.94; 5 1.194,0.94
DSG8_P9X1P6 = smd 0.508 x 0.279: 1 -0.94,0.762; 2 -0.94,0.254; 3 -0.94,-0.254; 4 -0.94,-0.762; 5 0.94,-0.762; 6 0.94,-0.254; 7 0.94,0.254; 8 0.94,0.762 | smd 0.889 x 1.6: 9 0,0
DSE6 = smd 0.965 x 0.305: 1 -0.553,0.5 | smd 0.864 x 0.305: 2 -0.603,0; 3 -0.603,-0.5; 4 0.603,-0.5; 5 0.603,0; 6 0.603,0.5
SOT23-5L = smd 0.55 x 1.2: 1 -0.95,-1.3; 2 0,-1.3; 3 0.95,-1.3; 4 0.95,1.3; 5 -0.95,1.3
SM77H = smd 1.6 x 1.5: 1 -2.55,-1.9; 2 2.55,-1.9; 3 2.55,1.9; 4 -2.55,1.9

### Placement (x,y rotation side)
BATCON  67.5,58.5 180 bottom
C1  36,4 0 top
C2  40,4 0 top
C3  36,10.5 0 top
C4  40,10.5 0 top
C5  36,17 0 top
C6  40,17 0 top
C7  36,23.5 0 top
C8  40,23.5 0 top
C9  36,30 0 top
C10  40,30 0 top
C11  36,36.5 0 top
C12  40,36.5 0 top
C13  36,43 0 top
C14  40,43 0 top
C15  36,49.5 0 top
C16  40,49.5 0 top
C17  24,4 0 top
C18  28,4 0 top
C19  24,10.5 0 top
C20  28,10.5 0 top
C21  24,17 0 top
C22  28,17 0 top
C23  24,23.5 0 top
C24  28,23.5 0 top
C25  24,30 0 top
C26  28,30 0 top
C27  24,36.5 0 top
C28  28,36.5 0 top
C29  24,43 0 top
C30  28,43 0 top
C31  24,49.5 0 top
C32  28,49.5 0 top
C33  53.5,51 180 top
C34  24,56 0 top
C35  28,56 0 top
C36  62,26 90 bottom
C37  69,6.5 180 top
C38  73,10 90 top
C39  65.5,10 90 top
C40  58,10.5 90 top
C41  55.5,9 90 top
C42  90,4 90 top
C43  82.5,6 90 top
C44  80,4 90 top
C45  89,56 0 top
C46  79,51.5 90 top
C47  82.5,51.5 90 top
C48  88.5,51.5 90 top
C49  56.5,25 90 bottom
C50  54.5,25.5 90 bottom
C51  53,25.5 90 bottom
C52  51.5,25.5 90 bottom
C53  52.9,36.5 270 bottom
C54  54.2,36.5 270 bottom
C55  51,36.5 270 bottom
C56  55.5,36.5 270 bottom
C57  55.5,40 0 top
C58  55.5,41.5 0 top
C59  58,23 0 top
C60  60.5,19 180 top
C61  52.5,18 180 top
C62  52.5,20.4 180 top
C63  53,22 180 top
C64  48,39 270 top
C65  84,11.5 0 bottom
C66  84,9 0 bottom
C67  72,51.5 90 top
C68  59,36 180 bottom
C69  59,33.4 180 bottom
C70  59,31.5 180 bottom
CN1  95.5,49.5 90 top
D1  32,5 0 top
D2  32,11.5 0 top
D3  32,18 0 top
D4  32,24.5 0 top
D5  32,31 0 top
D6  32,37.5 0 top
D7  32,44 0 top
D8  32,50.5 0 top
D9  20,5 0 top
D10  20,11.5 0 top
D11  20,18 0 top
D12  20,24.5 0 top
D13  20,31 0 top
D14  20,37.5 0 top
D15  20,44 0 top
D16  20,50.5 0 top
D17  20,57 0 top
JP1  62.5,40 0 top
L1  76.5,3 0 top
L2  52,8 180 top
LED1  95.5,20 270 top
LED2  95.5,24 270 top
LED3  95.5,28 270 top
PCB1  0,0 0 top
Q1  73,58 270 top
Q2  77,58 270 top
R1  36,6 0 top
R2  40,6 0 top
R3  36,12.5 0 top
R4  40,12.5 0 top
R5  36,19 0 top
R6  40,19 0 top
R7  36,25.5 0 top
R8  40,25.5 0 top
R9  36,32 0 top
R10  40,32 0 top
R11  36,38.5 0 top
R12  40,38.5 0 top
R13  36,45 0 top
R14  40,45 0 top
R15  36,51.5 0 top
R16  40,51.5 0 top
R17  24,6 0 top
R18  28,6 0 top
R19  24,12.5 0 top
R20  28,12.5 0 top
R21  24,19 0 top
R22  28,19 0 top
R23  24,25.5 0 top
R24  28,25.5 0 top
R25  24,32 0 top
R26  28,32 0 top
R27  24,38.5 0 top
R28  28,38.5 0 top
R29  24,45 0 top
R30  28,45 0 top
R31  24,51.5 0 top
R32  28,51.5 0 top
R33  53.5,53.5 0 top
R34  24,58 0 top
R35  28,58 0 top
R36  89,58.5 180 top
R37  84.5,56 0 top
R38  59.5,40 90 top
R39  67.5,40 0 top
R40  67.5,37.5 0 top
R41  78,10 90 top
R42  85.5,7 180 top
R43  85.5,9 0 top
R44  61,14 0 top
R45  61,12 180 top
R46  67.5,45 0 top
R47  67.5,42.5 0 top
R48  94,13 0 bottom
R49  95.5,22 0 top
R50  95.5,26 0 top
R51  95.5,30 0 top
S1  97,13 90 top
SV1  53.5,46.5 180 top
SV2  12,31 90 top
TEENSY  80,31 0 top
U1  80,29.5 90 bottom
U2  54,31 0 top
U3  69,9 0 top
U4  61,9 180 top
U5  85.5,4 180 top
U6  85.5,51.5 180 top
U7  82.5,58.5 0 top
U8  75.5,51.5 270 top
U$5  [KOM_LOGO]  64,51 0 bottom
X1  66,26 90 top

### Tracks (layer width: path | path; a pad name or v marks a point on that pad's centre or on a via)
+2V5
  Top 0.305: R42.1 86,6.55 86,6 85.5,5.5 85.5,4 84.56,3.06 U5.5 84.3,3.05 | 77.5,3.05 L1.2
  Top 0.61: 84.3,3.05 C44.1 77.5,3.05
+3V3  (via drill 0.5)
  Top 0.254: U2.50 57.25,35.45 v56.9,35.1 | U2.48 58.25,34.75 v58,34.5 | R38.2 v59.5,42.5 | X1.4 62.05,23.45 v62,23.5
  Top 0.61: TEENSY.3.3V 86.07,42.43 86,42.5 v86,39 | TEENSY.3.3V1 77.46,15.54 77.5,15.5 77.5,13.5 77,13 v76.5,13
  Route3 0.254: v59.5,42.5 59.5,36.5 58.5,35.5 57.3,35.5 v56.9,35.1
  Route3 0.61: v56.9,35.1 57,35 57,34.5 | v58,34.5 57,34.5 | 57,34.5 57,33.5 56.5,33 v56.5,31.5 60,31.5 62,29.5 v62,23.5 62,22 62.5,21.5 68,21.5 68.5,21 68.5,14.5 70,13 v76.5,13 77,13 77.5,13.5 77.5,16 78.5,17 85,17 86,18 v86,39
  Bottom 0.254: C68.1 57.8,36 v56.9,35.1 | C69.1 58.35,34.15 v58,34.5 | R48.2 89.5,13 89,12.5 89,7.5 88.5,7 84.5,7 | C36.1 v62,23.5
  Bottom 0.406: C70.1 v56.5,31.5 | C65.1 84.95,12.45 86.3,13.8 86.3,15.1 85,16.5 85,17.5 | 85,17.5 | 85,17.5 U1.1 | C66.1 C65.1 | C65.1 84.95,7.45 84.5,7 78.5,7 76.5,9 v76.5,13
-2V5
  Top 0.305: C41.1 L2.1 | U4.5 60.06,8.06 61,9 61,10.5 61.5,11 61.5,12 R45.1
  Top 0.61: U4.5 C41.1
ABIAS
  Top 0.254: R34.1 22,58 21,57 21,55.95 D17.2
  Top 0.305: D17.2 20.95,54.95 20,54 12.14,54 SV2.38
ADS_!CS  (via drill 0.5)
  Top 0.254: U2.39 64.25,30.25 v65,31 | TEENSY.10 72.31,19.5 70.5,19.5 v70.5,21
  Bottom 0.254: v65,31 70,31 70.5,30.5 v70.5,21
ADS_!DRDY
  Top 0.254: U2.47 61.75,34.25 63.5,36 73.5,36 74,35.5 74,33.89 TEENSY.5
ADS_!PWDN  (via drill 0.5)
  Top 0.254: U2.35 57.75,28.25 v57,29 | R39.2 72.27,40 TEENSY.2 71,39.78 v71,38.5
  Bottom 0.254: v57,29 57,29.8 57.5,30.3 62,30.3 62.5,30.8 62.5,34.5 65.5,37.5 70,37.5 v71,38.5
ADS_!RESET  (via drill 0.5)
  Top 0.254: U2.36 58.25,28.75 58,29 v58,29.5 | TEENSY.3 73.5,37.5 73,37 v71,37 70.5,37.5 R40.2
  Bottom 0.254: v58,29.5 62.5,29.5 63,30 63,34 66,37 v71,37
ADS_CLK
  Top 0.254: U2.37 62.25,29.25 63,28.5 64.05,28.5 X1.3
ADS_START
  Top 0.254: U2.38 65.25,29.75 66,30.5 66,33.5 67.5,35 72.19,35 TEENSY.4
AINN1
  Top 0.254: R17.1 22,6 21,5 21,3.95 D9.2
  Top 0.305: 21,5 21,3 20.5,2.5 18,2.5 17.5,3 17.5,7.5 14.5,10.5 11.82,10.5 SV2.4
AINN2
  Top 0.254: R19.1 22,12.5 21,11.5 21,10.45 D10.2
  Top 0.305: 21,11.5 21,9.5 20.5,9 18,9 17.5,9.5 17.5,13.5 15.5,15.5 11.74,15.5 SV2.8
AINN3
  Top 0.254: R21.1 22,19 21,18 21,16.95 D11.2
  Top 0.305: 21,18 21,16 20.5,15.5 18,15.5 17.5,16 17.5,18 14.5,21 12.16,21 SV2.12
AINN4
  Top 0.254: R23.1 22,25.5 21,24.5 21,23.45 D12.2
  Top 0.305: 21,24.5 21,22.5 20.5,22 18,22 14,26 12.08,26 SV2.16
AINN5
  Top 0.254: R25.1 22,32 21,31 21,29.95 D13.2
  Top 0.305: D13.2 20.95,28.95 20.5,28.5 17.5,28.5 15,31 12,31 SV2.20
AINN6
  Top 0.254: R27.1 22,38.5 21,37.5 21,36.45 D14.2
  Top 0.305: D14.2 20.95,35.45 20.5,35 15,35 14,36 11.92,36 SV2.24
AINN7
  Top 0.254: R29.1 22,45 21,44 21,42.95 D15.2
  Top 0.305: D15.2 20.95,41.95 20,41 11.84,41 SV2.28
AINN8
  Top 0.254: R31.1 22,51.5 21,50.5 21,49.45 D16.2
  Top 0.305: D16.2 20.95,48.45 20.5,48 16,48 14,46 11.76,46 SV2.32
AINP1
  Top 0.254: R1.1 34,6 33,5 33,3.95 D1.2
  Top 0.305: 33,5 33,3 32.5,2.5 28.5,2.5 27.5,1.5 18,1.5 16.5,3 16.5,6.18 SV2.3
AINP2
  Top 0.254: R3.1 34,12.5 33,11.5 33,10.45 D2.2
  Top 0.305: 33,11.5 33,9.5 32.5,9 28.5,9 27,7.5 18.5,7.5 16.5,9.5 16.5,11.26 SV2.7
AINP3
  Top 0.254: R5.1 34,19 33,18 33,16.95 D3.2
  Top 0.305: 33,18 33,16 32.5,15.5 28.5,15.5 27,14 18.5,14 13.5,19 13.5,19.34 SV2.11
AINP4
  Top 0.254: R7.1 34,25.5 33,24.5 33,23.45 D4.2
  Top 0.305: 33,24.5 33,22.5 32.5,22 28.5,22 27,20.5 17.42,20.5 SV2.15
AINP5
  Top 0.254: R9.1 34,32 33,31 33,29.95 D5.2
  Top 0.305: D5.2 32.95,28.95 32.5,28.5 28.5,28.5 27,27 16,27 SV2.19
AINP6
  Top 0.254: R11.1 34,38.5 33,37.5 33,36.45 D6.2
  Top 0.305: D6.2 32.95,35.45 32.5,35 28.5,35 27,33.5 14.58,33.5 SV2.23
AINP7
  Top 0.254: R13.1 34,45 33,44 33,42.95 D7.2
  Top 0.305: D7.2 32.95,41.95 32.5,41.5 28.5,41.5 27,40 13.38,40 SV2.27
AINP8
  Top 0.254: R15.1 34,51.5 33,50.5 33,49.45 D8.2
  Top 0.305: D8.2 32.95,48.45 32.5,48 28.5,48 27,46.5 16,46.5 14.5,45 13.3,45 SV2.31
BIASOUT
  Top 0.254: R35.2 C35.2 | U2.63 50.75,43.25 49.7,44.3 49.7,46.49 SV1.9
  Top 0.305: C35.2 44.4,56 arc-45 44.57,55.93 48,52.5 48,48.3 arc45 48.07,48.12 SV1.9
  Bottom 0.254: SV1.9 SV1.7 SV1.5
GND  (via drill 0.5)
  Top 0.254: C9.1 35.05,28.55 v35,28.5 | X1.2 66.55,28.55 v66,28 | U2.33 59.62,26.62 v59.5,26.5 | U2.31 57.25,24.35 57.5,24.1 58.6,24.1 v59,24.5 | U2.51 56.75,37.55 v57.5,38.3 | U2.49 58.12,36.62 v58.7,37.2 | R43.2 v88,9 | R39.1 v65,40 | R40.1 66,37.5 v65,38.5 | C44.2 78.55,4.95 v78.5,5 | R47.1 v65,42.5 | R46.1 v65,45 | R41.1 78,7 v77.5,6.5 | R36.1 v91.5,58.5 | C43.2 82.5,8 v81.5,9
  Top 0.305: C1.1 35.05,2.55 v35,2.5 | C2.1 39.05,2.55 v39,2.5 | D1.1 31.05,4.95 v30.5,5.5 | D9.1 19.05,4.95 v18.5,5.5 | C17.1 23.05,2.55 v23,2.5 | C18.1 27.05,2.55 v27,2.5 | C34.1 23.05,54.55 v23,54.5 | C35.1 27.05,54.55 v27,54.5 | D17.1 19.05,56.95 v18.5,57.5 | C15.1 35.05,48.05 v35,48 | C16.1 39.05,48.05 v39,48 | C31.1 23.05,48.05 v23,48 | C32.1 27.05,48.05 v27,48 | D16.1 19.05,50.45 v18.5,51 | D8.1 31.05,50.45 v30.5,51 | C13.1 35.05,41.55 v35,41.5 | C14.1 39.05,41.55 v39,41.5 | D15.1 19.05,43.95 v18.5,44.5 | D7.1 31.05,43.95 v30.5,44.5 | C29.1 23.05,41.55 v23,41.5 | C30.1 27.05,41.55 v27,41.5 | C27.1 23.05,35.05 v23,35 | C28.1 27.05,35.05 v27,35 | D14.1 19.05,37.45 v18.5,38 | C12.1 39.05,35.05 v39,35 | C11.1 35.05,35.05 v35,35 | D6.1 31.05,37.45 v30.5,38 | C10.1 39.05,28.55 v39,28.5 | D13.1 19.05,30.95 v18.5,31.5 | D5.1 31.05,30.95 v30.5,31.5 | C25.1 23.05,28.55 v23,28.5 | C26.1 27.05,28.55 v27,28.5 | C23.1 23.05,22.05 v23,22 | C24.1 27.05,22.05 v27,22 | D12.1 19.05,24.45 v18.5,25 | C8.1 39.05,22.05 v39,22 | C7.1 35.05,22.05 v35,22 | D4.1 31.05,24.45 v30.5,25 | C5.1 35.05,15.55 v35,15.5 | C6.1 39.05,15.55 v39,15.5 | D3.1 31.05,17.95 v30.5,18.5 | D11.1 19.05,17.95 v18.5,18.5 | C21.1 23.05,15.55 v23,15.5 | C22.1 27.05,15.55 v27,15.5 | C3.1 35.05,9.05 v35,9 | C4.1 39.05,9.05 v39,9 | C19.1 23.05,9.05 v23,9 | C20.1 27.05,9.05 v27,9 | D10.1 19.05,11.45 v18.5,12 | D2.1 31.05,11.45 v30.5,12 | U6.2 85.75,51.25 | U3.1 67.78,10.78 v68,11 | C39.2 v65.5,12.5 | U4.1 62.19,7.31 v62.5,7 | C41.2 v55.5,11.5 | C40.2 v58,13 | R44.2 v63.5,14 | R50.1 v93,26 | R49.1 v93,22 | R51.1 v93,30 | U5.2 v88.5,4
  Top 0.406: 85.75,51.25 U6.9 | U6.6 85.25,51.75 U6.9 | U6.5 84.74,52.26 U6.9 | CN1.GND 91.44,51.46 91.4,51.5
  Top 0.61: C48.2 88.5,54 | 88.5,54 v89.2,54 | 88.5,54 v87.8,54 | C47.2 82.5,54 | 82.5,54 v83.2,54 | 82.5,54 v81.8,54 | v85.5,53 U6.9 v85.5,50 | C46.2 79,54 | 79,54 v79.7,54 | 79,54 v78.3,54 | U8.2 v75.5,51.5 | C67.2 72,54 | 72,54 v72.7,54 | 72,54 v71.3,54 | 91.4,51.5 91.4,52 | 91.4,52 v92,52 | v90.5,52 91.4,52 | C42.2 v90,6.5 | v71.5,11 72.95,11 C38.2
  Bottom 0.254: C68.2 59.65,37.05 59.5,37.2 v58.7,37.2 | C69.2 v61.5,33.4 | C70.2 v61.5,31.5 | C36.2 63.45,26.95 v63.5,27
  Bottom 0.406: U1.2 82.54,19.46 82.6,19.5 | 82.6,19.5 v81.9,19.5 | 82.6,19.5 v83.1,19.5 | C65.2 v81.5,11.5 | C66.2 v81.5,9
  other vias: 75.9,55.4 77.1,55.4 76.5,54.4 85.5,46.2 85.5,45 85.5,43.8 80.8,10.5 79.5,10.5 76.1,47.8 76.1,46.5
  pour Route2 (isolate 0.254): 0,62 100,62 100,0 0,0
  pour Top (isolate 0.254, rank 2, no thermals): 77.5,57 77.5,54 75.5,54 75.5,57
  pour Top: 85,46.5 90.5,46.5 90.5,43.5 85,43.5
  pour Top (isolate 0.254, no thermals): 79.5,15 80.5,15 80.5,11.5 81.5,10.5 81.5,10 80,10 79,10 79,11 79.5,11.5
  pour Top: 72,48.5 76.5,48.5 76.5,46 72.5,46 72,46
INN1
  Top 0.254: C18.2 R18.2
  Top 0.305: U2.15 47.25,27.75 44.5,25 44.5,8 44,7.5 29.5,7.5 29,7 29,6.05 R18.2
INN2
  Top 0.254: R20.2 C20.2
  Top 0.305: U2.13 46.25,28.75 43.5,26 43.5,14.5 43,14 29.5,14 29,13.5 29,12.55 R20.2
INN3
  Top 0.254: R22.2 28.95,18.5 C22.2
  Top 0.305: U2.11 45.25,29.75 42.5,27 42.5,21 42,20.5 29.5,20.5 29,20 29,18.55 28.95,18.5
INN4
  Top 0.254: C24.2 R24.2
  Top 0.305: U2.9 44.25,30.75 40.5,27 29.5,27 29,26.5 29,25.55 R24.2
INN5
  Top 0.254: C26.2 R26.2
  Top 0.305: U2.7 43.75,31.75 42,33.5 29.5,33.5 29,33 29,32.05 R26.2
INN6
  Top 0.254: C28.2 R28.2
  Top 0.305: U2.5 44.75,32.75 42.5,35 42.5,39.5 42,40 29.5,40 29,39.5 29,38.55 R28.2
INN7
  Top 0.254: R30.2 C30.2
  Top 0.305: U2.3 45.75,33.75 44.5,35 44.5,45.5 43.5,46.5 29.5,46.5 29,46 29,45.05 R30.2
INN8
  Top 0.254: C32.2 R32.2
  Top 0.305: U2.1 46.75,34.75 46.5,35 46.5,52 45.5,53 29.5,53 28.95,52.45 R32.2
INP1
  Top 0.254: R2.2 C2.2
  Top 0.305: U2.16 48.25,27.25 45,24 45,6.5 44.5,6 R2.2
INP2
  Top 0.254: R4.2 C4.2
  Top 0.305: U2.14 46.75,28.25 44,25.5 44,13 43.5,12.5 R4.2
INP3
  Top 0.254: R6.2 C6.2
  Top 0.305: U2.12 45.75,29.25 43,26.5 43,19.5 42.5,19 R6.2
INP4
  Top 0.254: R8.2 C8.2
  Top 0.305: U2.10 44.75,30.25 41,26.5 41,25.55 R8.2 40.5,25.5
INP5
  Top 0.254: C10.2 40.95,31.95 41,32 R10.2
  Top 0.305: U2.8 42.75,31.25 42,32 R10.2
INP6
  Top 0.254: R12.2 C12.2
  Top 0.305: U2.6 44.25,32.25 41,35.5 41,36.45 C12.2
INP7
  Top 0.254: C14.2 R14.2
  Top 0.305: U2.4 45.25,33.25 43.5,35 43.5,42 42.5,43 C14.2
INP8
  Top 0.254: R16.2 C16.2
  Top 0.305: U2.2 46.25,34.25 45.5,35 45.5,48.5 44.5,49.5 C16.2
MISO  (via drill 0.5)
  Top 0.254: TEENSY.12 72.49,14.49 | U2.43 62.75,32.25 v64,33.5 | v82.5,39.5 79.5,36.5 79.5,19 79,18.5 76.5,18.5 76,18 76,16.5 75,15.5 74,15.5 73,14.5 TEENSY.12 | v70,16 70,14.5 TEENSY.12
  Bottom 0.254: v82.5,39.5 82.5,41.55 U1.9 | v64,33.5 64,30.5 64.5,30 69,30 69.5,29.5 69.5,16.5 v70,16
MOSI  (via drill 0.5)
  Top 0.254: v80,39.5 79,38.5 79,19.5 78.5,19 74,19 73.65,18.65 TEENSY.11 72.35,17 68.5,17 68,17.5 68,21.5 67.5,22 61.5,22 61,22.5 61,27.5 60.75,27.75 U2.34
  Bottom 0.254: v80,39.5 U1.8
N$1
  Top 0.305: C40.1 58.39,9.94 U4.4 59.81,11.76 R45.2 R44.1
N$2
  Top 0.254: C1.2 R1.2 R2.1
N$3
  Top 0.254: U8.4 U8.5 U8.1
  Top 0.406: U6.8 84.14,50.74 84.1,50.7
  Top 0.61: 84.1,50.7 82.65,50.7 C47.1 C46.1 U8.4
N$4
  Top 0.254: TEENSY.15/A1 91.93,19.57 92.5,19 92.5,15 93,14.5 97.5,14.5 98,15 98,15.02 S1.2
  Bottom 0.254: R48.1 95.98,13 S1.2
N$5
  Top 0.254: C3.2 R3.2 R4.1
N$6
  Top 0.254: C34.2 R34.2 R35.1
N$7
  Top 0.254: LED1.A 93,20 91,22 86.46,22 TEENSY.16/A2
N$8
  Top 0.254: R6.1 R5.2 C5.2
N$10
  Top 0.254: LED2.A 92,24 91.5,24.5 89.04,24.5 TEENSY.17/A3
N$11
  Top 0.254: R8.1 R7.2 C7.2
N$12
  Top 0.254: U2.62 51.25,43.25 53,45 53.27,45 SV1.6
  Bottom 0.254: SV1.10 48.42,44.08 49,43.5 53,43.5 53.5,44 SV1.6
N$13
  Top 0.254: LED3.A 90,28 89,27 86.5,27 86,27.5 86.04,27.5 TEENSY.18/A4
N$14
  Top 0.254: R10.1 R9.2 C9.2
N$15
  Top 0.254: SV1.8 50.96,45.96 52.2,47.2 52.2,49.3 52.5,49.6 52.5,50.95 C33.2 R33.1
N$16
  Top 0.305: R49.2 96.45,20.1 LED1.C
N$17
  Top 0.254: R12.1 R11.2 C11.2
N$18
  Top 0.254: U2.61 51.75,42.75 53,44 55.5,44 56,44.5 56,45.19 SV1.4 54.8,46.47 54.8,49.4 54.45,49.75 C33.1 R33.2
N$19
  Top 0.305: R50.2 96.45,24.05 96.5,24 LED2.C
N$20
  Top 0.254: C13.2 R13.2 R14.1
N$21
  Top 0.305: U3.6 69.44,9.94 69,9.5 69,7.5 69.5,7 69.5,6.95 C37.1
N$22
  Top 0.305: R51.2 96.45,28.1 LED3.C
N$23
  Top 0.254: R16.1 R15.2 C15.2
N$24
  Top 0.254: U2.60 52.25,42.25 53.5,43.5 57.5,43.5 58.5,44.5 58.5,45.15 SV1.2
N$25
  pour Top: 82,32.8 84,32.8 84,23 82,23
N$26
  Top 0.254: R18.1 R17.2 C17.2
N$27
  Top 0.305: U3.3 67.78,6.77 C37.2
N$28
  pour Top: 76,31.5 78,31.5 78,28 76,28
N$29
  Top 0.254: C19.2 R19.2 R20.1
N$30
  Top 0.305: 65.55,9 C39.1 65.45,9
  Top 0.61: U3.2 65.55,9 | U4.2 65.45,9
N$32
  Top 0.254: C21.2 R21.2 R22.1
N$35
  Top 0.254: C23.2 R23.2 R24.1
N$36
  Top 0.305: R43.1 R42.2 84.31,6.76 U5.4 82.61,4.94 C43.1
N$38
  Top 0.254: R26.1 R25.2 C25.2
N$39  (via drill 0.5)
  Top 0.254: U7.4 v84.5,58 | v91.5,56 C45.2
  Top 0.61: Q1.3 Q1.2 Q1.1 70.51,56.49 70,57 70,59.5 69.5,60 67,60 66.5,59.5 BATCON.2
  Bottom 0.254: v84.5,58 84.5,60 | 84.5,60 67,60 66.5,59.5 BATCON.2 | v91.5,56 92,56 92.5,56.5 92.5,59.5 92,60 84.5,60
N$41
  Top 0.254: C27.2 R27.2 R28.1
N$42
  Top 0.254: Q2.4 79.99,56.49 80.5,57 80.5,58 81,58.5 U7.2
N$44
  Top 0.254: C29.2 R29.2 R30.1
N$45  (via drill 0.5)
  Top 0.254: U7.3 81.5,58 81,57.5 v81,56 | v74,55.5 74,56.46 Q1.4
  Bottom 0.254: v81,56 80.5,56 80,56.5 75,56.5 v74,55.5
N$47
  Top 0.254: R32.1 R31.2 C31.2
N$48
  Top 0.254: U7.6 83.7,59 83.9,59.2 86.3,59.2 87,58.5 R36.2
N$49
  Top 0.254: U7.5 83.9,58.5 84.2,58.8 85.1,58.8 85.45,58.45 R37.2 C45.1
N$50
  pour Top (isolate 0.254, no thermals): 71,60 71,57.5 71,57 79,57 79,61.5 71,61.5
N$51
  Top 0.254: U2.52 56.25,37.65 56.7,38.1 56.7,38.7 57.5,39.5 59.05,39.5 R38.1 59.82,38.73 JP1.1
N$58
  Top 0.254: U2.64 50.25,39.25 50,39.5 48.15,39.5 C64.1
NRF_!RESET  (via drill 0.5)
  Top 0.254: v74.5,26 74.5,27 73.84,27 TEENSY.7 | R41.2 78,11.8 v78.7,12.5
  Bottom 0.254: v78.7,12.5 78.7,14.8 80,16.1 U1.3 80,20.5 v74.5,26
NRF_RDYN  (via drill 0.5)
  Top 0.254: v74,24.5 71.26,24.5 TEENSY.8
  Bottom 0.254: U1.10 85,41.51 85,35 78.5,28.5 74,28.5 73.5,28 73.5,25 v74,24.5
NRF_REQN  (via drill 0.5)
  Top 0.254: v77.5,39.5 78.5,38.5 78.5,23 77.61,22.11 TEENSY.9
  Bottom 0.254: U1.7 77.46,39.54 v77.5,39.5
PSU_NEG  (via drill 0.5)
  Top 0.254: U4.3 62.94,9.94 v63.5,10.5 | U3.4 71.44,8.06 v71.5,8 72,7.5 76,7.5 76.5,8 76.5,10 76.2,10.3 76.2,11.2 79,14 79,16 80,17 80,35.5 83.5,39 83.5,42 83.07,42.43 TEENSY.1 72.31,42.5 R47.2
  Bottom 0.254: v63.5,10.5 64,10 71.5,10 v71.5,8
PSU_POS
  Top 0.254: U5.3 87.94,4.94 88.5,5.5 88.5,7.5 89.5,8.5 89.5,10 88.5,11 83.8,11 81.3,13.5 81.3,15.2 80.5,16 80.5,35 84,38.5 84,44.5 83.53,44.97 TEENSY.0 72.35,45 R46.2
SCK  (via drill 0.5)
  Top 0.254: U2.40 63.25,30.75 v65,32.5 | v81.5,33.5 81,33 81,23 85.5,18.5 88.5,18.5 89,18 89,14.6 TEENSY.13
  Bottom 0.254: U1.6 74.92,39.58 v75,39.5 75,33.5 | v65,32.5 65.5,32.5 66.5,33.5 75,33.5 | 75,33.5 v81.5,33.5
SRB1  (via drill 0.5)
  Top 0.254: U2.17 48.38,25.38 v48,25
  Bottom 0.254: v48,25 48,42 48.5,42.5 56.3,42.5 57.3,43.5 57.3,46.49 SV1.1
SRB2  (via drill 0.5)
  Top 0.254: U2.18 50.75,24.25 50.5,24 v47,24
  Bottom 0.254: v47,24 47,25.5 47.5,26 47.5,42.5 48,43 54.3,43 54.8,43.5 54.8,46.53 SV1.3
V+  (via drill 0.5)
  Top 0.254: v52.7,23.5 52.75,23.65 U2.22 U2.21 | U2.19 51.25,23.75 v51.5,23.5 | U2.59 52.75,37.75 v53.5,38.5 54.25,37.75 U2.56 | U2.54 55.25,38.45 v55.3,38.5
  Route3 0.406: v55.3,38.5 v53.5,38.5 50,38.5 v49.5,38 49,37.5 49,24.5 50,23.5 v51.5,23.5 v52.7,23.5
  Bottom 0.254: C50.1 C51.1 53,24.3 52.7,24 v52.7,23.5 | C52.1 v51.5,23.5 | C53.1 52.9,37.9 v53.5,38.5 54.2,37.8 C54.1 | C56.1 55.5,38.3 v55.3,38.5
  Bottom 0.406: C55.1 50.05,37.45 v49.5,38 | C49.1 55.55,24.05 55,23.5 v52.7,23.5
  other vias: 74,3 72.8,3 71.6,3
  pour Top: 76,4 76,2 71,2 71,4
  pour Route3: 75,4 75,2 46,2 46,40 56.5,40 56.5,37 49.5,37 49,37 49,25 53.5,25 53.5,22.5 48.5,22.5 48.5,4.5 75,4.5
V-  (via drill 0.5)
  Top 0.254: U2.58 U2.57 53.62,36.62 53.5,36.5 v53.5,34.5 | U2.32 57.75,26.75 v57,27.5 | U2.25 54.25,27.25 v54.5,27.5 | v53,27.5 53.25,27.25 U2.23 53.25,24.25 53.6,23.9 53.6,23.2 53.1,22.7 52.6,22.7 52.5,22.6 52.5,22.15 C63.2 52,22 51.5,21.5 51.5,20.45 C62.2 v50,20.4 | U2.20 51.75,27.25 v51.5,27.5 | v55.8,34.5 55.75,34.55 U2.53 55.75,37.75 56.15,38.15 C57.2 56.15,41.2 C58.2 | C61.2 v50,18 | C64.2 48,37 v50.5,34.5
  Top 0.305: C59.2 58.95,21.55 v59,21.5
  Top 0.406: v66,20 64.88,20 C60.- 64.88,18 v66,18
  Route3 0.406: v55.8,34.5 v53.5,34.5 v50.5,34.5 50,34 50,28 50.5,27.5 v51.5,27.5 v53,27.5 v54.5,27.5 55.5,27.5 | 55.5,27.5 v57,27.5 | 55.5,20.4 55.5,20 | 55.5,20 55.5,18 | 55.5,18 v50,18 | v50,20.4 55.5,20.4 | v66,18 55.5,18 | v66,20 55.5,20 | 55.5,20.4 55.5,21.5 | 55.5,21.5 55.5,27.5 | v59,21.5 55.5,21.5
  Bottom 0.254: C56.2 55.5,34.8 v55.8,34.5 | C52.2 v51.5,27.5 | C51.2 v53,27.5 | C50.2 v54.5,27.5 | C53.2 52.9,35.1 v53.5,34.5 54.2,35.2 C54.2
  Bottom 0.406: C55.2 51,35 v50.5,34.5 | C49.2 56.5,27 v57,27.5
  other vias: 51,11.9 51,10.7 51,9.5
  pour Top: 52,7 50,7 50,12.4 52,12.4
  pour Route3: 52,9 52,13 56,17 66.5,17 66.5,20.5 59.5,20.5 59.5,22.5 57.5,24.5 57.5,27 55,29.5 55,33 56,34 56,36 50,36 50,26 54.5,26 54.5,21.5 49.5,21.5 49.5,9
VAC
  Top 0.406: U6.1 86.96,50.74 87.1,50.6
  Top 0.61: CN1.VBUS 89.6,47.9 89.5,48 89.5,48.5 88.5,49.5 C48.1 88.45,50.6 87.1,50.6 87,50.7
VBAT  (via drill 0.5)
  Top 0.254: R37.1 82.8,56 v82,55.2
  Top 0.305: 73.45,9 C38.1 | C42.1
  Top 0.61: U8.3 C67.1 69.95,50.55 68.5,52 BATCON.1 | U3.5 73.45,9 | U5.1 C42.1 | v75.5,9 73.55,9 C38.1 | v92,3 90.05,3 C42.1 | TEENSY.VIN 86.01,47.51 86,47.5 v84,47.5 v82.8,47.5
  Route3 0.254: v82,55.2 82,57 81.5,57.5 69.5,57.5 BATCON.1
  Route3 0.61: BATCON.1 68.5,51 70.5,49 82,49 | 82,49 89,49 90,48 90,8 | v75.5,9 76.5,8 90,8 | 90,8 91.5,8 92,7.5 v92,3 | v84,47.5 v82.8,47.5 82.5,47.5 82,48 82,49
VCAP1
  Top 0.254: U2.28 55.75,21.75 57,20.5 57,19.12 C60.+
VCAP2
  Top 0.254: U2.30 56.75,23.3 C59.1
VCAP3
  Top 0.254: U2.55 54.75,37.85 54.4,38.2 54.4,38.9 54.85,39.35 C57.1 54.85,41.2 C58.1
VCAP4
  Top 0.254: U2.26 54.75,18.25 54.5,18 C61.1
VREFP
  Top 0.254: U2.24 53.75,24.45 54.1,24.1 54.1,22.9 53.7,22.5 53.7,22.05 C63.1 53.65,20.6 C62.1

### Text on the board
tPlace: BIASOUT | IN8 | IN7 | IN6 | IN5 | IN4 | IN3 | IN2 | IN1 | INxN | INxP
bPlace: Bluetooth Low Energy connected / EMG recorder | nRF8001 / module | ferdinand.keil@gmail.com | sandro.hardy@kom.tu-darmstadt.de
tStop: v11 | 02/06/2014